# Altium project FIT_TCM.PrjPcb (part 5 of 9)

## Sheet FIT_TCM_LEMO_OUT.SchDoc: FIT_PM12 board
size 420 x 297 mm; CheckedBy: G.Kasprowicz; Author: INR Moscow; CompanyName: WUT ISE; DrawnBy: M.Podgórski; Organization: WUT ISE; Address1: PW ISE; Address2: Nowowiejska 15/19 00-665 Warsaw; Address3: gkasprow@gmail.com; Revision: 2; SheetNumber: -; SheetTotal: -; ModifiedBy: -; CheckedDate: -; Title2: Title 2; DivGrp: WUT ISE; Designer: INR RAS; ModifiedDate: -; ProjectName: Sensor Box
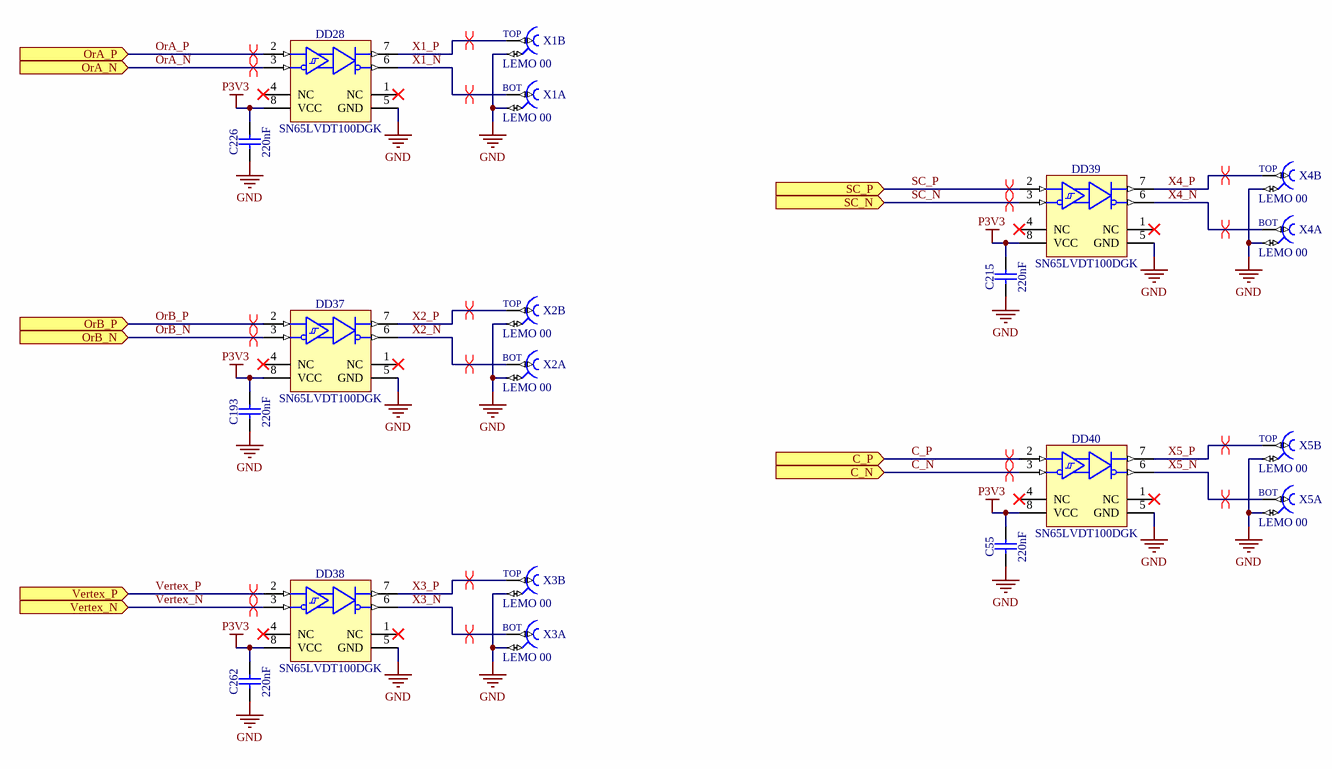
[diagram p13: FIT_TCM_LEMO_OUT.SchDoc]

### Parts
C55  220nF  [CAPC2012X135N]
C193  220nF  [CAPC2012X135N]
C215  220nF  [CAPC2012X135N]
C226  220nF  [CAPC2012X135N]
C262  220nF  [CAPC2012X135N]
DD28  SN65LVDT100DGK  [SOP65P490X110-8N]
DD37  SN65LVDT100DGK  [SOP65P490X110-8N]
DD38  SN65LVDT100DGK  [SOP65P490X110-8N]
DD39  SN65LVDT100DGK  [SOP65P490X110-8N]
DD40  SN65LVDT100DGK  [SOP65P490X110-8N]
X1  LEMO 00  [LEMO_EPY.00.250.NTN]  (parts A,B of 2)
X2  LEMO 00  [LEMO_EPY.00.250.NTN]  (parts A,B of 2)
X3  LEMO 00  [LEMO_EPY.00.250.NTN]  (parts A,B of 2)
X4  LEMO 00  [LEMO_EPY.00.250.NTN]  (parts A,B of 2)
X5  LEMO 00  [LEMO_EPY.00.250.NTN]  (parts A,B of 2)

### Ports
C_N (in), C_P (in), OrA_N (in), OrA_P (in), OrB_N (in), OrB_P (in), SC_N (in), SC_P (in), Vertex_N (in), Vertex_P (in)

### Nets
GND: C55.1 C193.1 C215.1 C226.1 C262.1 DD28.5(GND) DD37.5(GND) DD38.5(GND) DD39.5(GND) DD40.5(GND) X1.3 X2.3 X3.3 X4.3 X5.3
P3V3: C55.2 C193.2 C215.2 C226.2 C262.2 DD28.8(VCC) DD37.8(VCC) DD38.8(VCC) DD39.8(VCC) DD40.8(VCC)
C_N: DD40.3(B) ; port C_N
C_P: DD40.2(A) ; port C_P
OrA_N: DD28.3(B) ; port OrA_N
OrA_P: DD28.2(A) ; port OrA_P
OrB_N: DD37.3(B) ; port OrB_N
OrB_P: DD37.2(A) ; port OrB_P
SC_N: DD39.3(B) ; port SC_N
SC_P: DD39.2(A) ; port SC_P
Vertex_N: DD38.3(B) ; port Vertex_N
Vertex_P: DD38.2(A) ; port Vertex_P
X1_N: DD28.6(Z) X1.1
X1_P: DD28.7(Y) X1.2
X2_N: DD37.6(Z) X2.1
X2_P: DD37.7(Y) X2.2
X3_N: DD38.6(Z) X3.1
X3_P: DD38.7(Y) X3.2
X4_N: DD39.6(Z) X4.1
X4_P: DD39.7(Y) X4.2
X5_N: DD40.6(Z) X5.1
X5_P: DD40.7(Y) X5.2

Not connected (* = marked no-connect by the designer): DD28 1(NC)* 4(NC)*; DD37 1(NC)* 4(NC)*; DD38 1(NC)* 4(NC)*; DD39 1(NC)* 4(NC)*; DD40 1(NC)* 4(NC)*

### Layout directives
differential pair: C_N, C_P, OrA_N, OrA_P, OrB_N, OrB_P, SC_N, SC_P, Vertex_N, Vertex_P, X1_N, X1_P, X2_N, X2_P, X3_N, X3_P, X4_N, X4_P, X5_N, X5_P

### Notes on the sheet
- Project/Equipment
- Document
- Designer
- Drawn by
- Check.by
- Copyright WUT ISE 2024.
  This documentation describes Open Hardware and is licensed under the CERN OHL v.2. You may redistribute and modify this documentation under the terms of the CERN OHL v.2. (http://ohwr.org/CERNOHL). This documentation is distributed WITHOUT ANY EXPRESS OR IMPLIED WARRANTY, INCLUDING OF MERCHANTABILITY, SATISFACTORY QUALITY AND FITNESS FOR A PARTICULAR PURPOSE. Please see the CERN OHL v.2 for applicable conditions.
- Contact
- File
- Last Mod.
- Print Date
- Sheet
- Size
- A3
- of
- Rev
- (in symbol LEMO_EPY.00.250.NTN, part A) BOT
- (in symbol LEMO_EPY.00.250.NTN, part B) TOP

### Library data of the parts
C55 C193 C215 C226 C262 = CC0805_220NF_50V_10%_X7R: as C31-C35 on sheet FIT_TCM_SI5338A; Part Number: CC0805_220NF_50V_10%_X7R; Component Kind: Standard; Component Type: Standard; Pin Count: 2; Value: 220nF; Status: Preferred; Manufacturer Part Number: CC0805_220NF_50V_10%_X7R; Case: 0805; Mounted: Yes; Socket: No; SMD: Yes; Sense: No; Manufacturer1 Example: MURATA; Manufacturer1 ComponentHeight: 1.35mm; HelpURL: \\cern.ch\dfs\Applications\Altium\Datasheets\CC0805_X7R_MURATA.pdf; Author: CERN DEM JLC; CreateDate: 03.12.2007; LatestRevisionDate: 03.12.2007
DD28 DD37-DD40 = SN65LVDT100DGK: 2Gbps LVDS/LVPECL/CML to LVDS Translator/Repeater; Manufacturer: TEXAS INSTRUMENTS; PressFit: No; Bonding: No; Part Number: SN65LVDT100DGK; Component Kind: Standard; Component Type: Standard; Device: SN65LVDT100DGK; PackageDescription: SOP, 0.65mm Pitch; 8 Pin, 3.00mm W X 3.00mm L X 1.10mm H body, IPC Medium Density; Part Description: 2Gbps LVDS/LVPECL/CML to LVDS Translator/Repeater; Manufacturer Part Number: SN65LVDT100DGK; Pin Count: 8; Case: SSOP8; Mounted: Yes; Socket: No; SMD: Yes; Sense: No; ComponentHeight: 1.1mm; Author: CERN DEM HF; HelpURL: \\cern.ch\dfs\Applications\Altium\Datasheets\SN65LVDT100D.pdf; CreateDate: 21.06.2023; LatestRevisionDate: 21.06.2023
X1-X5 = LEMO_EPY.00.250.NTN: Dual Female Coax 1-2 Common Shield 3; Part Description: Size 00, Dual 50 Ohms Coaxial Elbow Sockets (90°); PressFit: No; SCEM: 09.46.11.186.0; Part Number: LEMO_EPY.00.250.NTN; Component Kind: Standard; Component Type: Standard; Pin Count: 4; Family: LEMO 00; Mounted: Yes; Socket: No; SMD: No; Sense: No; Status: None; Manufacturer: LEMO; Manufacturer Part Number: EPY.00.250.NTN; ComponentHeight: 14.8mm; HelpURL: \\cern.ch\dfs\Applications\Altium\Datasheets\LEMO_EPY.00.250.NTN.pdf; Author: CERN DEM JMW; CreateDate: 10.12.2008; LatestRevisionDate: 11.08.2009

## Sheet FPGA.SchDoc: FIT_PM12 board
size 420 x 297 mm; CheckedBy: G.Kasprowicz; Author: INR Moscow; CompanyName: WUT ISE; DrawnBy: M.Podgórski; Organization: WUT ISE; Address1: PW ISE; Address2: Nowowiejska 15/19 00-665 Warsaw; Address3: gkasprow@gmail.com; Revision: 2; SheetNumber: -; SheetTotal: -; ModifiedBy: -; CheckedDate: -; Title2: Title 2; DivGrp: WUT ISE; Designer: INR RAS; ModifiedDate: -; ProjectName: Sensor Box
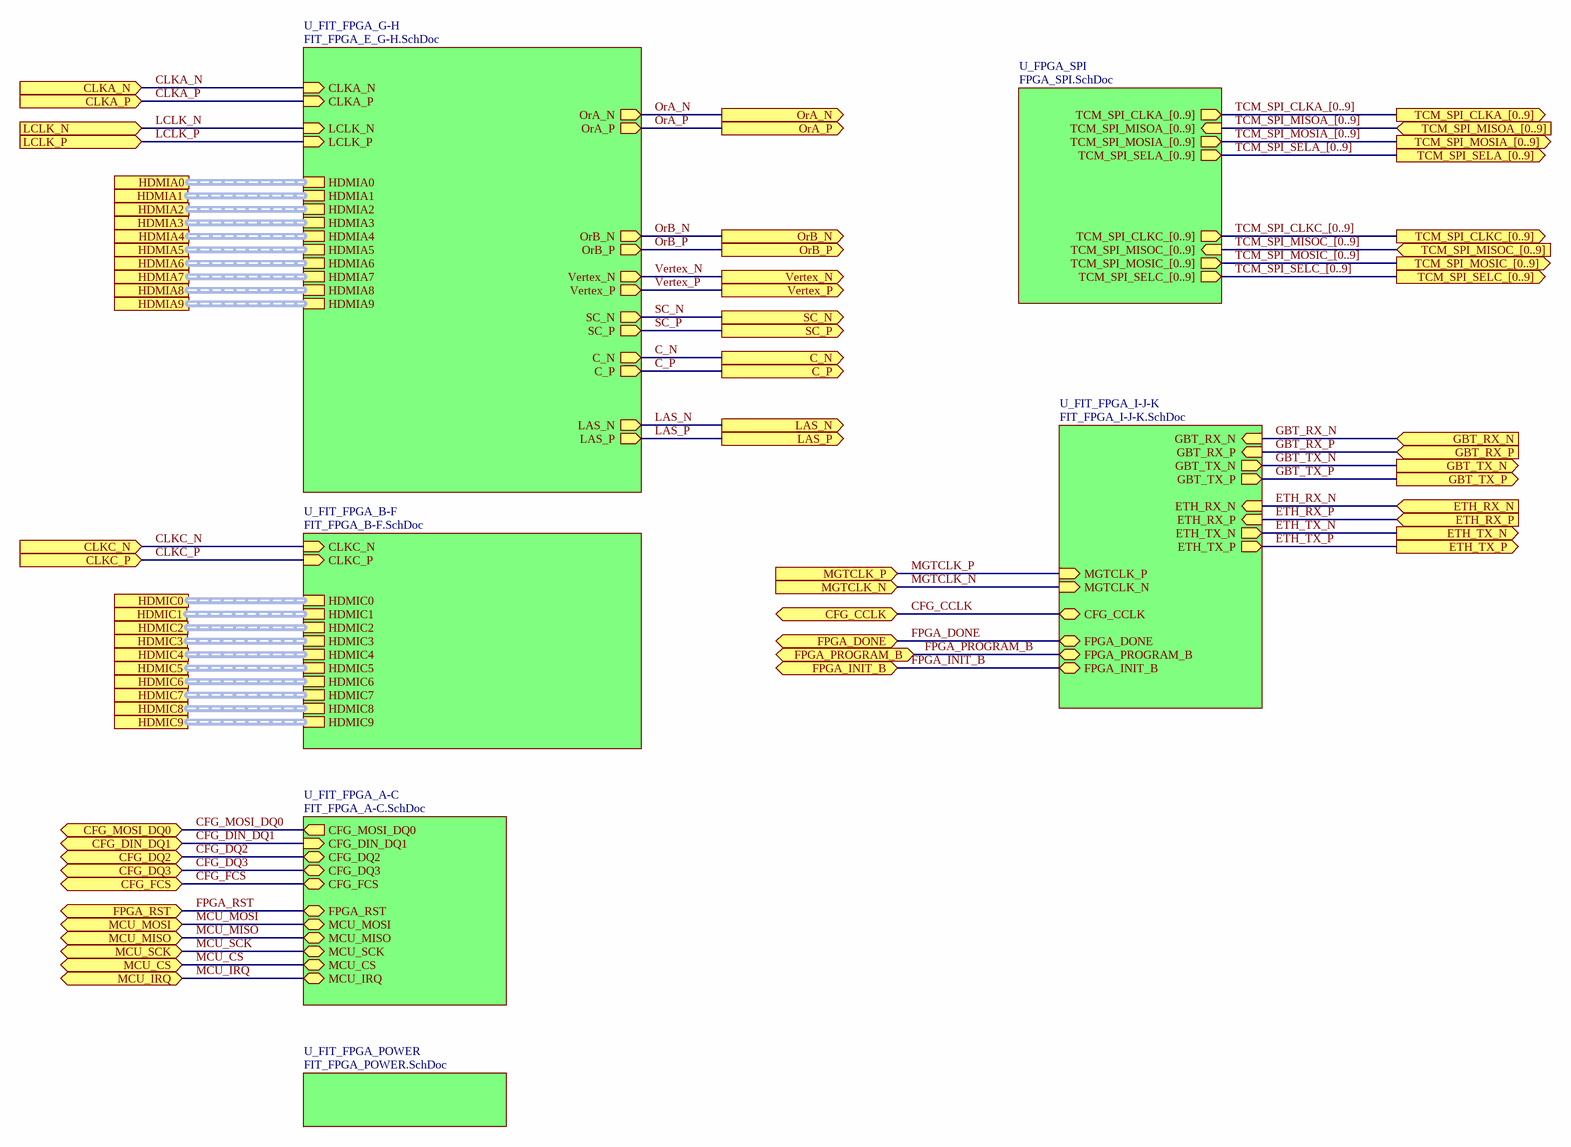
[diagram p14: FPGA.SchDoc]

### Sub-sheets
U_FIT_FPGA_A-C = FIT_FPGA_A-C.SchDoc: CFG_MOSI_DQ0 (out), CFG_DIN_DQ1 (in), CFG_DQ2 (bidir), CFG_DQ3 (bidir), CFG_FCS (bidir), MCU_MISO (bidir), MCU_CS (bidir), MCU_IRQ (bidir), MCU_MOSI (bidir), FPGA_RST (bidir), MCU_SCK (bidir)
U_FIT_FPGA_B-F = FIT_FPGA_B-F.SchDoc: CLKC_P (in), CLKC_N (in), HDMIC8 (harness HDMI_SIG), HDMIC9 (harness HDMI_SIG), HDMIC6 (harness HDMI_SIG), HDMIC7 (harness HDMI_SIG), HDMIC4 (harness HDMI_SIG), HDMIC5 (harness HDMI_SIG), HDMIC2 (harness HDMI_SIG), HDMIC3 (harness HDMI_SIG), HDMIC0 (harness HDMI_SIG), HDMIC1 (harness HDMI_SIG)
U_FIT_FPGA_G-H = FIT_FPGA_E_G-H.SchDoc: LCLK_P (in), LCLK_N (in), LAS_P (out), LAS_N (out), OrA_P (out), OrA_N (out), SC_P (out), SC_N (out), C_P (out), C_N (out), OrB_P (out), OrB_N (out), Vertex_P (out), Vertex_N (out), CLKA_P (in), CLKA_N (in), HDMIA8 (harness HDMI_SIG), HDMIA9 (harness HDMI_SIG), HDMIA6 (harness HDMI_SIG), HDMIA7 (harness HDMI_SIG), HDMIA4 (harness HDMI_SIG), HDMIA5 (harness HDMI_SIG), HDMIA2 (harness HDMI_SIG), HDMIA3 (harness HDMI_SIG), HDMIA0 (harness HDMI_SIG), HDMIA1 (harness HDMI_SIG)
U_FIT_FPGA_I-J-K = FIT_FPGA_I-J-K.SchDoc: ETH_TX_P (out), ETH_TX_N (out), ETH_RX_P (in), ETH_RX_N (in), GBT_RX_P (in), GBT_RX_N (in), GBT_TX_P (out), GBT_TX_N (out), MGTCLK_P (in), MGTCLK_N (in), CFG_CCLK (bidir), FPGA_PROGRAM_B (bidir), FPGA_INIT_B (bidir), FPGA_DONE (bidir)
U_FIT_FPGA_POWER = FIT_FPGA_POWER.SchDoc: no entries
U_FPGA_SPI = FPGA_SPI.SchDoc: TCM_SPI_SELC_[0..9] (out), TCM_SPI_MOSIC_[0..9] (out), TCM_SPI_MISOC_[0..9] (in), TCM_SPI_CLKC_[0..9] (out), TCM_SPI_CLKA_[0..9] (out), TCM_SPI_MOSIA_[0..9] (out), TCM_SPI_MISOA_[0..9] (in), TCM_SPI_SELA_[0..9] (out)

### Ports
C_N (out), C_P (out), CFG_CCLK (bidir), CFG_DIN_DQ1 (bidir), CFG_DQ2 (bidir), CFG_DQ3 (bidir), CFG_FCS (bidir), CFG_MOSI_DQ0 (bidir), CLKA_N (in), CLKA_P (in), CLKC_N (in), CLKC_P (in), ETH_RX_N (in), ETH_RX_P (in), ETH_TX_N (out), ETH_TX_P (out), FPGA_DONE (bidir), FPGA_INIT_B (bidir), FPGA_PROGRAM_B (bidir), FPGA_RST (bidir), GBT_RX_N (in), GBT_RX_P (in), GBT_TX_N (out), GBT_TX_P (out), HDMIA0 (harness HDMI_SIG), HDMIA1 (harness HDMI_SIG), HDMIA2 (harness HDMI_SIG), HDMIA3 (harness HDMI_SIG), HDMIA4 (harness HDMI_SIG), HDMIA5 (harness HDMI_SIG), HDMIA6 (harness HDMI_SIG), HDMIA7 (harness HDMI_SIG), HDMIA8 (harness HDMI_SIG), HDMIA9 (harness HDMI_SIG), HDMIC0 (harness HDMI_SIG), HDMIC1 (harness HDMI_SIG), HDMIC2 (harness HDMI_SIG), HDMIC3 (harness HDMI_SIG), HDMIC4 (harness HDMI_SIG), HDMIC5 (harness HDMI_SIG), HDMIC6 (harness HDMI_SIG), HDMIC7 (harness HDMI_SIG), HDMIC8 (harness HDMI_SIG), HDMIC9 (harness HDMI_SIG), LAS_N (out), LAS_P (out), LCLK_N (in), LCLK_P (in), MCU_CS (bidir), MCU_IRQ (bidir), MCU_MISO (bidir), MCU_MOSI (bidir), MCU_SCK (bidir), MGTCLK_N (in), MGTCLK_P (in), OrA_N (out), OrA_P (out), OrB_N (out), OrB_P (out), SC_N (out), SC_P (out), TCM_SPI_CLKA_[0..9] (out), TCM_SPI_CLKC_[0..9] (out), TCM_SPI_MISOA_[0..9] (in), TCM_SPI_MISOC_[0..9] (in), TCM_SPI_MOSIA_[0..9] (out), TCM_SPI_MOSIC_[0..9] (out), TCM_SPI_SELA_[0..9] (out), TCM_SPI_SELC_[0..9] (out), Vertex_N (out), Vertex_P (out)

### Nets
C_N: port C_N, sheet U_FIT_FPGA_G-H/C_N
C_P: port C_P, sheet U_FIT_FPGA_G-H/C_P
CFG_CCLK: port CFG_CCLK, sheet U_FIT_FPGA_I-J-K/CFG_CCLK
CFG_DIN_DQ1: port CFG_DIN_DQ1, sheet U_FIT_FPGA_A-C/CFG_DIN_DQ1
CFG_DQ2: port CFG_DQ2, sheet U_FIT_FPGA_A-C/CFG_DQ2
CFG_DQ3: port CFG_DQ3, sheet U_FIT_FPGA_A-C/CFG_DQ3
CFG_FCS: port CFG_FCS, sheet U_FIT_FPGA_A-C/CFG_FCS
CFG_MOSI_DQ0: port CFG_MOSI_DQ0, sheet U_FIT_FPGA_A-C/CFG_MOSI_DQ0
CLKA_N: port CLKA_N, sheet U_FIT_FPGA_G-H/CLKA_N
CLKA_P: port CLKA_P, sheet U_FIT_FPGA_G-H/CLKA_P
CLKC_N: port CLKC_N, sheet U_FIT_FPGA_B-F/CLKC_N
CLKC_P: port CLKC_P, sheet U_FIT_FPGA_B-F/CLKC_P
ETH_RX_N: port ETH_RX_N, sheet U_FIT_FPGA_I-J-K/ETH_RX_N
ETH_RX_P: port ETH_RX_P, sheet U_FIT_FPGA_I-J-K/ETH_RX_P
ETH_TX_N: port ETH_TX_N, sheet U_FIT_FPGA_I-J-K/ETH_TX_N
ETH_TX_P: port ETH_TX_P, sheet U_FIT_FPGA_I-J-K/ETH_TX_P
FPGA_DONE: port FPGA_DONE, sheet U_FIT_FPGA_I-J-K/FPGA_DONE
FPGA_INIT_B: port FPGA_INIT_B, sheet U_FIT_FPGA_I-J-K/FPGA_INIT_B
FPGA_PROGRAM_B: port FPGA_PROGRAM_B, sheet U_FIT_FPGA_I-J-K/FPGA_PROGRAM_B
FPGA_RST: port FPGA_RST, sheet U_FIT_FPGA_A-C/FPGA_RST
GBT_RX_N: port GBT_RX_N, sheet U_FIT_FPGA_I-J-K/GBT_RX_N
GBT_RX_P: port GBT_RX_P, sheet U_FIT_FPGA_I-J-K/GBT_RX_P
GBT_TX_N: port GBT_TX_N, sheet U_FIT_FPGA_I-J-K/GBT_TX_N
GBT_TX_P: port GBT_TX_P, sheet U_FIT_FPGA_I-J-K/GBT_TX_P
LAS_N: port LAS_N, sheet U_FIT_FPGA_G-H/LAS_N
LAS_P: port LAS_P, sheet U_FIT_FPGA_G-H/LAS_P
LCLK_N: port LCLK_N, sheet U_FIT_FPGA_G-H/LCLK_N
LCLK_P: port LCLK_P, sheet U_FIT_FPGA_G-H/LCLK_P
MCU_CS: port MCU_CS, sheet U_FIT_FPGA_A-C/MCU_CS
MCU_IRQ: port MCU_IRQ, sheet U_FIT_FPGA_A-C/MCU_IRQ
MCU_MISO: port MCU_MISO, sheet U_FIT_FPGA_A-C/MCU_MISO
MCU_MOSI: port MCU_MOSI, sheet U_FIT_FPGA_A-C/MCU_MOSI
MCU_SCK: port MCU_SCK, sheet U_FIT_FPGA_A-C/MCU_SCK
MGTCLK_N: port MGTCLK_N, sheet U_FIT_FPGA_I-J-K/MGTCLK_N
MGTCLK_P: port MGTCLK_P, sheet U_FIT_FPGA_I-J-K/MGTCLK_P
OrA_N: port OrA_N, sheet U_FIT_FPGA_G-H/OrA_N
OrA_P: port OrA_P, sheet U_FIT_FPGA_G-H/OrA_P
OrB_N: port OrB_N, sheet U_FIT_FPGA_G-H/OrB_N
OrB_P: port OrB_P, sheet U_FIT_FPGA_G-H/OrB_P
SC_N: port SC_N, sheet U_FIT_FPGA_G-H/SC_N
SC_P: port SC_P, sheet U_FIT_FPGA_G-H/SC_P
Vertex_N: port Vertex_N, sheet U_FIT_FPGA_G-H/Vertex_N
Vertex_P: port Vertex_P, sheet U_FIT_FPGA_G-H/Vertex_P

### Buses and harness runs
bus TCM_SPI_CLKA_[0..9] = port TCM_SPI_CLKA_[0..9] = sheet U_FPGA_SPI/TCM_SPI_CLKA_[0..9]
bus TCM_SPI_CLKC_[0..9] = port TCM_SPI_CLKC_[0..9] = sheet U_FPGA_SPI/TCM_SPI_CLKC_[0..9]
bus TCM_SPI_MISOA_[0..9] = port TCM_SPI_MISOA_[0..9] = sheet U_FPGA_SPI/TCM_SPI_MISOA_[0..9]
bus TCM_SPI_MISOC_[0..9] = port TCM_SPI_MISOC_[0..9] = sheet U_FPGA_SPI/TCM_SPI_MISOC_[0..9]
bus TCM_SPI_MOSIA_[0..9] = port TCM_SPI_MOSIA_[0..9] = sheet U_FPGA_SPI/TCM_SPI_MOSIA_[0..9]
bus TCM_SPI_MOSIC_[0..9] = port TCM_SPI_MOSIC_[0..9] = sheet U_FPGA_SPI/TCM_SPI_MOSIC_[0..9]
bus TCM_SPI_SELA_[0..9] = port TCM_SPI_SELA_[0..9] = sheet U_FPGA_SPI/TCM_SPI_SELA_[0..9]
bus TCM_SPI_SELC_[0..9] = port TCM_SPI_SELC_[0..9] = sheet U_FPGA_SPI/TCM_SPI_SELC_[0..9]
harness port HDMIA0 = sheet U_FIT_FPGA_G-H/HDMIA0
harness port HDMIA1 = sheet U_FIT_FPGA_G-H/HDMIA1
harness port HDMIA2 = sheet U_FIT_FPGA_G-H/HDMIA2
harness port HDMIA3 = sheet U_FIT_FPGA_G-H/HDMIA3
harness port HDMIA4 = sheet U_FIT_FPGA_G-H/HDMIA4
harness port HDMIA5 = sheet U_FIT_FPGA_G-H/HDMIA5
harness port HDMIA6 = sheet U_FIT_FPGA_G-H/HDMIA6
harness port HDMIA7 = sheet U_FIT_FPGA_G-H/HDMIA7
harness port HDMIA8 = sheet U_FIT_FPGA_G-H/HDMIA8
harness port HDMIA9 = sheet U_FIT_FPGA_G-H/HDMIA9
harness port HDMIC0 = sheet U_FIT_FPGA_B-F/HDMIC0
harness port HDMIC1 = sheet U_FIT_FPGA_B-F/HDMIC1
harness port HDMIC2 = sheet U_FIT_FPGA_B-F/HDMIC2
harness port HDMIC3 = sheet U_FIT_FPGA_B-F/HDMIC3
harness port HDMIC4 = sheet U_FIT_FPGA_B-F/HDMIC4
harness port HDMIC5 = sheet U_FIT_FPGA_B-F/HDMIC5
harness port HDMIC6 = sheet U_FIT_FPGA_B-F/HDMIC6
harness port HDMIC7 = sheet U_FIT_FPGA_B-F/HDMIC7
harness port HDMIC8 = sheet U_FIT_FPGA_B-F/HDMIC8
harness port HDMIC9 = sheet U_FIT_FPGA_B-F/HDMIC9

### Notes on the sheet
- Project/Equipment
- Document
- Designer
- Drawn by
- Check.by
- Copyright WUT ISE 2024.
  This documentation describes Open Hardware and is licensed under the CERN OHL v.2. You may redistribute and modify this documentation under the terms of the CERN OHL v.2. (http://ohwr.org/CERNOHL). This documentation is distributed WITHOUT ANY EXPRESS OR IMPLIED WARRANTY, INCLUDING OF MERCHANTABILITY, SATISFACTORY QUALITY AND FITNESS FOR A PARTICULAR PURPOSE. Please see the CERN OHL v.2 for applicable conditions.
- Contact
- File
- Last Mod.
- Print Date
- Sheet
- Size
- A3
- of
- Rev

## Sheet FIT_FPGA_E_G-H.SchDoc: FIT_PM12 board
size 420 x 297 mm; CheckedBy: G.Kasprowicz; Author: INR Moscow; CompanyName: WUT ISE; DrawnBy: M.Podgórski; Organization: WUT ISE; Address1: PW ISE; Address2: Nowowiejska 15/19 00-665 Warsaw; Address3: gkasprow@gmail.com; Revision: 2; SheetNumber: -; SheetTotal: -; ModifiedBy: -; CheckedDate: -; Title2: Title 2; DivGrp: WUT ISE; Designer: INR RAS; ModifiedDate: -; ProjectName: Sensor Box
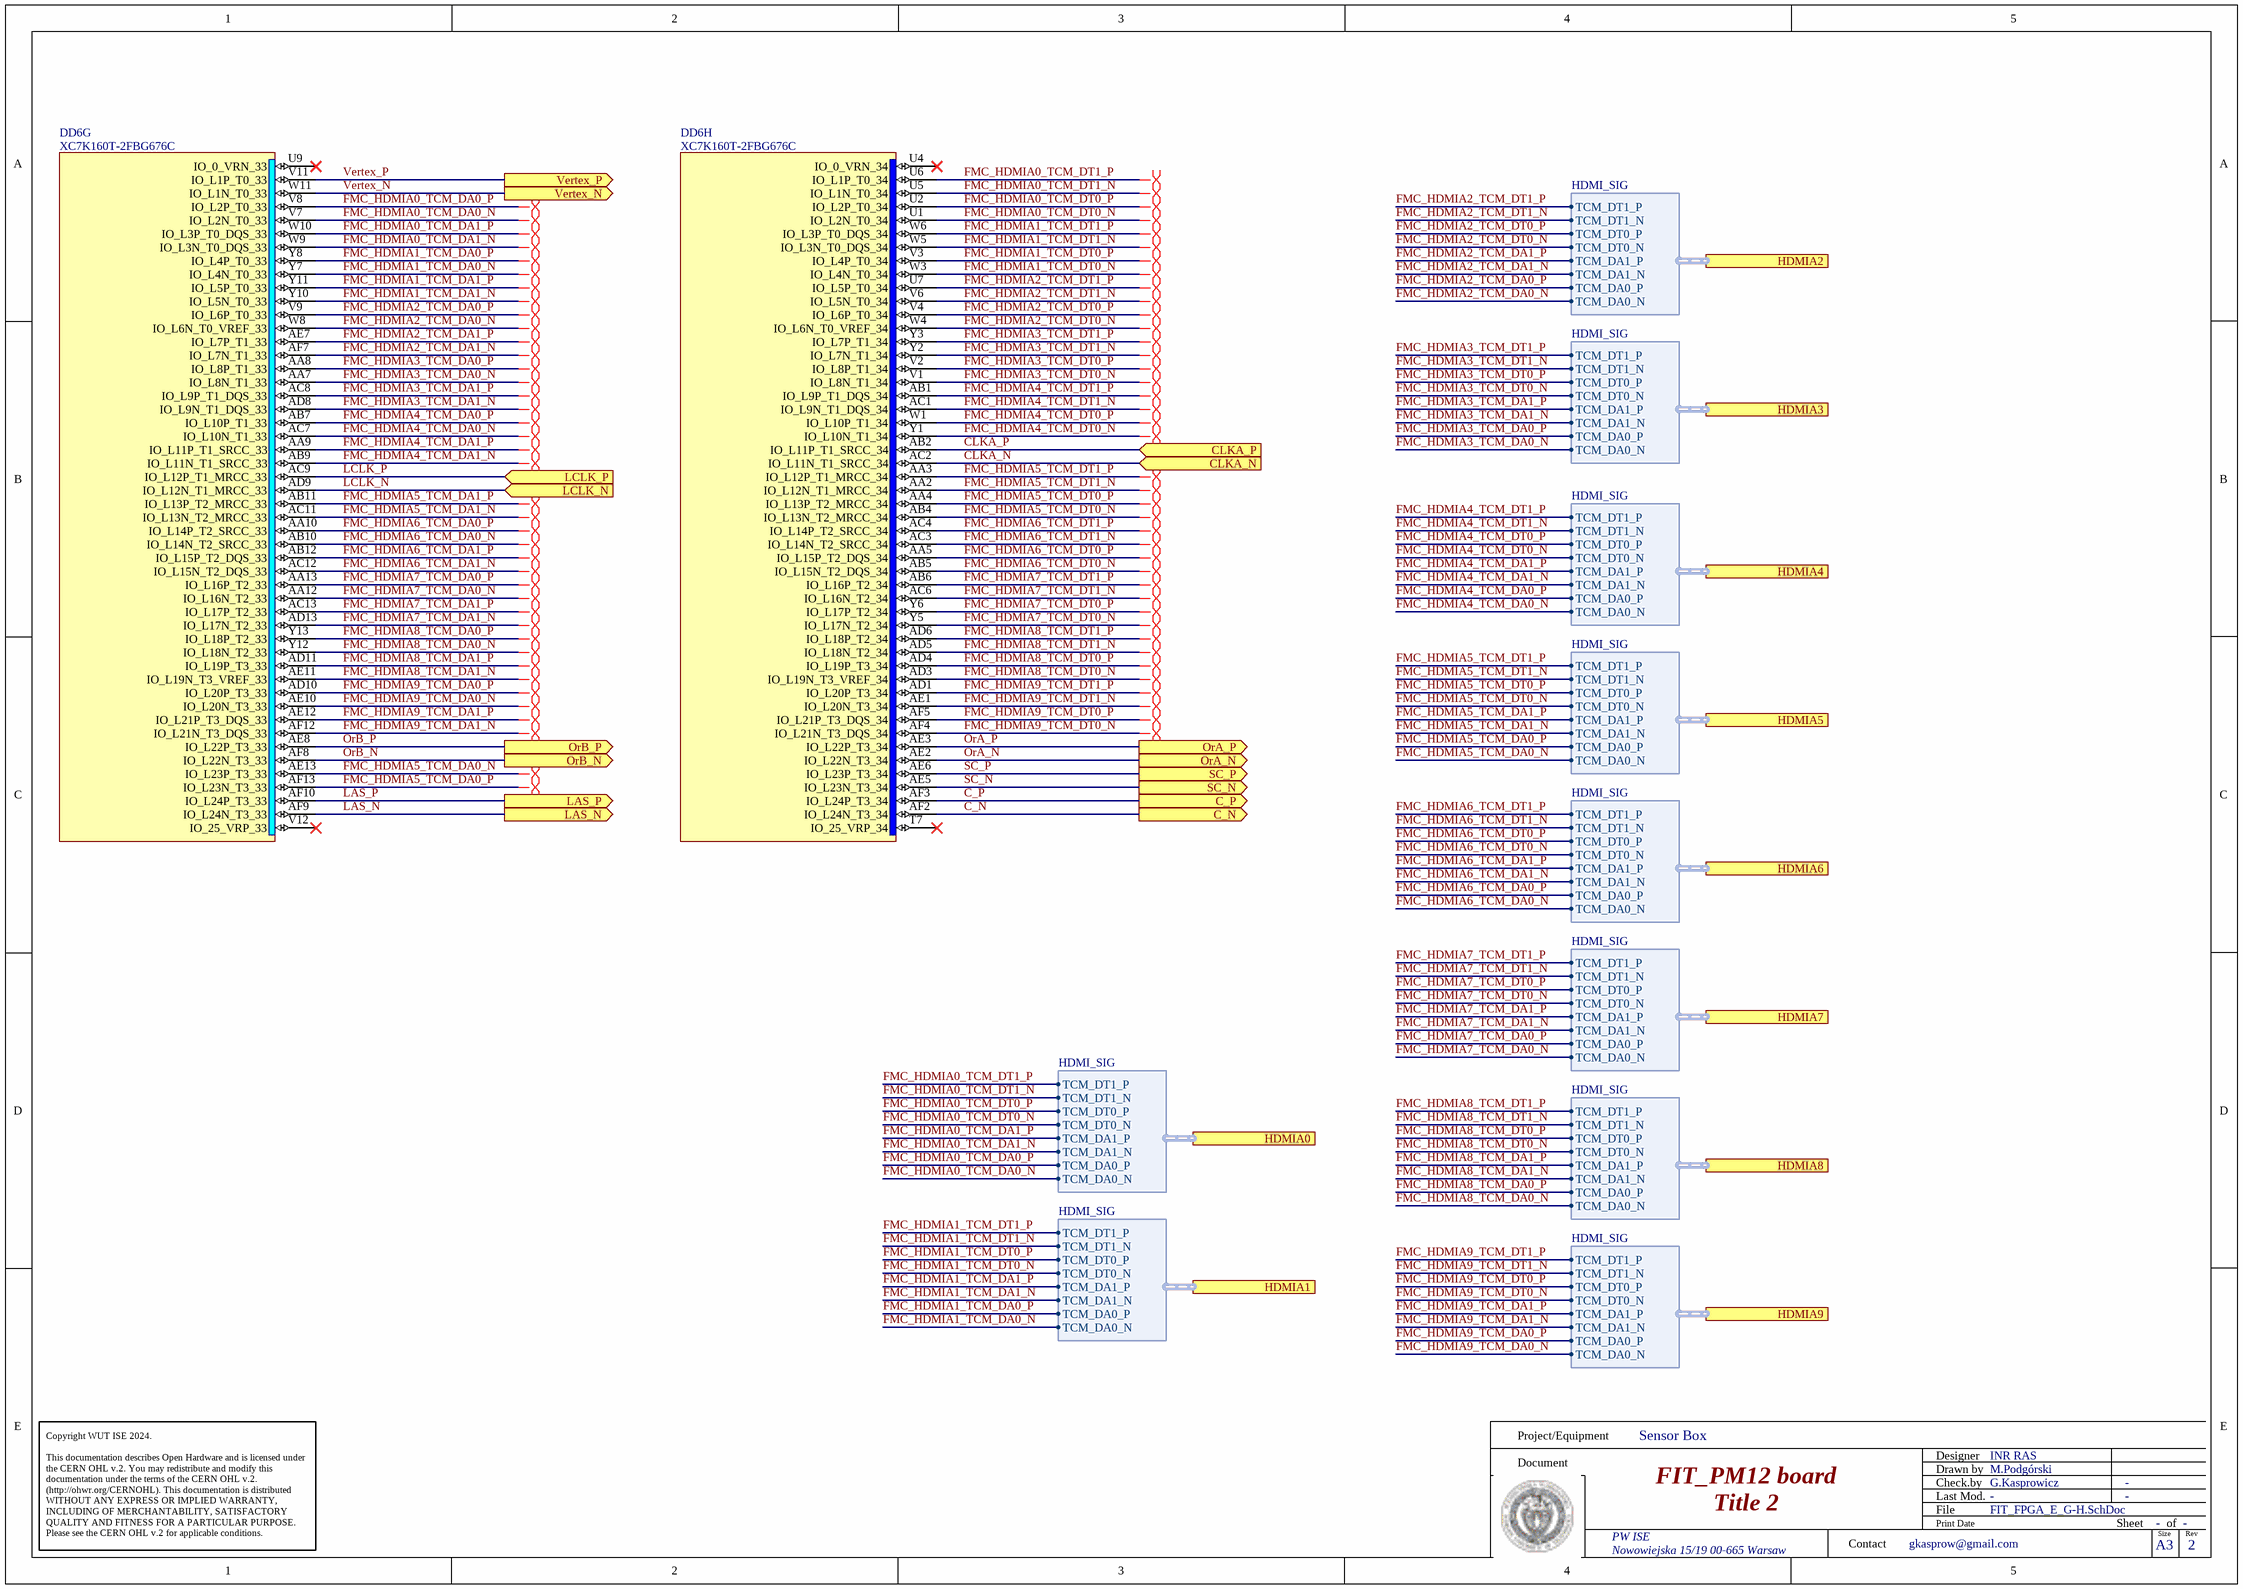
[diagram p15: FIT_FPGA_E_G-H.SchDoc]

### Parts
DD6  XC7K160T-2FBG676C  [BGA676C100P26X26_2700X2700X254]  (parts G,H of 15)

### Ports
C_N (out), C_P (out), CLKA_N (in), CLKA_P (in), HDMIA0 (harness HDMI_SIG), HDMIA1 (harness HDMI_SIG), HDMIA2 (harness HDMI_SIG), HDMIA3 (harness HDMI_SIG), HDMIA4 (harness HDMI_SIG), HDMIA5 (harness HDMI_SIG), HDMIA6 (harness HDMI_SIG), HDMIA7 (harness HDMI_SIG), HDMIA8 (harness HDMI_SIG), HDMIA9 (harness HDMI_SIG), LAS_N (out), LAS_P (out), LCLK_N (in), LCLK_P (in), OrA_N (out), OrA_P (out), OrB_N (out), OrB_P (out), SC_N (out), SC_P (out), Vertex_N (out), Vertex_P (out)

### Harnesses
HDMI_SIG: TCM_DT1_P, TCM_DT1_N, TCM_DT0_P, TCM_DT0_N, TCM_DA1_P, TCM_DA1_N, TCM_DA0_P, TCM_DA0_N

### Nets
C_N: DD6.AF2(IO_L24N_T3_34) ; port C_N
C_P: DD6.AF3(IO_L24P_T3_34) ; port C_P
CLKA_N: DD6.AC2(IO_L11N_T1_SRCC_34) ; port CLKA_N
CLKA_P: DD6.AB2(IO_L11P_T1_SRCC_34) ; port CLKA_P
FMC_HDMIA0_TCM_DA0_N: DD6.V7(IO_L2N_T0_33) ; port HDMIA0.TCM_DA0_N  [project net HDMIA0.TCM_DA0_N]
FMC_HDMIA0_TCM_DA0_P: DD6.V8(IO_L2P_T0_33) ; port HDMIA0.TCM_DA0_P  [project net HDMIA0.TCM_DA0_P]
FMC_HDMIA0_TCM_DA1_N: DD6.W9(IO_L3N_T0_DQS_33) ; port HDMIA0.TCM_DA1_N  [project net HDMIA0.TCM_DA1_N]
FMC_HDMIA0_TCM_DA1_P: DD6.W10(IO_L3P_T0_DQS_33) ; port HDMIA0.TCM_DA1_P  [project net HDMIA0.TCM_DA1_P]
FMC_HDMIA0_TCM_DT0_N: DD6.U1(IO_L2N_T0_34) ; port HDMIA0.TCM_DT0_N  [project net HDMIA0.TCM_DT0_N]
FMC_HDMIA0_TCM_DT0_P: DD6.U2(IO_L2P_T0_34) ; port HDMIA0.TCM_DT0_P  [project net HDMIA0.TCM_DT0_P]
FMC_HDMIA0_TCM_DT1_N: DD6.U5(IO_L1N_T0_34) ; port HDMIA0.TCM_DT1_N  [project net HDMIA0.TCM_DT1_N]
FMC_HDMIA0_TCM_DT1_P: DD6.U6(IO_L1P_T0_34) ; port HDMIA0.TCM_DT1_P  [project net HDMIA0.TCM_DT1_P]
FMC_HDMIA1_TCM_DA0_N: DD6.Y7(IO_L4N_T0_33) ; port HDMIA1.TCM_DA0_N  [project net HDMIA1.TCM_DA0_N]
FMC_HDMIA1_TCM_DA0_P: DD6.Y8(IO_L4P_T0_33) ; port HDMIA1.TCM_DA0_P  [project net HDMIA1.TCM_DA0_P]
FMC_HDMIA1_TCM_DA1_N: DD6.Y10(IO_L5N_T0_33) ; port HDMIA1.TCM_DA1_N  [project net HDMIA1.TCM_DA1_N]
FMC_HDMIA1_TCM_DA1_P: DD6.Y11(IO_L5P_T0_33) ; port HDMIA1.TCM_DA1_P  [project net HDMIA1.TCM_DA1_P]
FMC_HDMIA1_TCM_DT0_N: DD6.W3(IO_L4N_T0_34) ; port HDMIA1.TCM_DT0_N  [project net HDMIA1.TCM_DT0_N]
FMC_HDMIA1_TCM_DT0_P: DD6.V3(IO_L4P_T0_34) ; port HDMIA1.TCM_DT0_P  [project net HDMIA1.TCM_DT0_P]
FMC_HDMIA1_TCM_DT1_N: DD6.W5(IO_L3N_T0_DQS_34) ; port HDMIA1.TCM_DT1_N  [project net HDMIA1.TCM_DT1_N]
FMC_HDMIA1_TCM_DT1_P: DD6.W6(IO_L3P_T0_DQS_34) ; port HDMIA1.TCM_DT1_P  [project net HDMIA1.TCM_DT1_P]
FMC_HDMIA2_TCM_DA0_N: DD6.W8(IO_L6N_T0_VREF_33) ; port HDMIA2.TCM_DA0_N  [project net HDMIA2.TCM_DA0_N]
FMC_HDMIA2_TCM_DA0_P: DD6.V9(IO_L6P_T0_33) ; port HDMIA2.TCM_DA0_P  [project net HDMIA2.TCM_DA0_P]
FMC_HDMIA2_TCM_DA1_N: DD6.AF7(IO_L7N_T1_33) ; port HDMIA2.TCM_DA1_N  [project net HDMIA2.TCM_DA1_N]
FMC_HDMIA2_TCM_DA1_P: DD6.AE7(IO_L7P_T1_33) ; port HDMIA2.TCM_DA1_P  [project net HDMIA2.TCM_DA1_P]
FMC_HDMIA2_TCM_DT0_N: DD6.W4(IO_L6N_T0_VREF_34) ; port HDMIA2.TCM_DT0_N  [project net HDMIA2.TCM_DT0_N]
FMC_HDMIA2_TCM_DT0_P: DD6.V4(IO_L6P_T0_34) ; port HDMIA2.TCM_DT0_P  [project net HDMIA2.TCM_DT0_P]
FMC_HDMIA2_TCM_DT1_N: DD6.V6(IO_L5N_T0_34) ; port HDMIA2.TCM_DT1_N  [project net HDMIA2.TCM_DT1_N]
FMC_HDMIA2_TCM_DT1_P: DD6.U7(IO_L5P_T0_34) ; port HDMIA2.TCM_DT1_P  [project net HDMIA2.TCM_DT1_P]
FMC_HDMIA3_TCM_DA0_N: DD6.AA7(IO_L8N_T1_33) ; port HDMIA3.TCM_DA0_N  [project net HDMIA3.TCM_DA0_N]
FMC_HDMIA3_TCM_DA0_P: DD6.AA8(IO_L8P_T1_33) ; port HDMIA3.TCM_DA0_P  [project net HDMIA3.TCM_DA0_P]
FMC_HDMIA3_TCM_DA1_N: DD6.AD8(IO_L9N_T1_DQS_33) ; port HDMIA3.TCM_DA1_N  [project net HDMIA3.TCM_DA1_N]
FMC_HDMIA3_TCM_DA1_P: DD6.AC8(IO_L9P_T1_DQS_33) ; port HDMIA3.TCM_DA1_P  [project net HDMIA3.TCM_DA1_P]
FMC_HDMIA3_TCM_DT0_N: DD6.V1(IO_L8N_T1_34) ; port HDMIA3.TCM_DT0_N  [project net HDMIA3.TCM_DT0_N]
FMC_HDMIA3_TCM_DT0_P: DD6.V2(IO_L8P_T1_34) ; port HDMIA3.TCM_DT0_P  [project net HDMIA3.TCM_DT0_P]
FMC_HDMIA3_TCM_DT1_N: DD6.Y2(IO_L7N_T1_34) ; port HDMIA3.TCM_DT1_N  [project net HDMIA3.TCM_DT1_N]
FMC_HDMIA3_TCM_DT1_P: DD6.Y3(IO_L7P_T1_34) ; port HDMIA3.TCM_DT1_P  [project net HDMIA3.TCM_DT1_P]
FMC_HDMIA4_TCM_DA0_N: DD6.AC7(IO_L10N_T1_33) ; port HDMIA4.TCM_DA0_N  [project net HDMIA4.TCM_DA0_N]
FMC_HDMIA4_TCM_DA0_P: DD6.AB7(IO_L10P_T1_33) ; port HDMIA4.TCM_DA0_P  [project net HDMIA4.TCM_DA0_P]
FMC_HDMIA4_TCM_DA1_N: DD6.AB9(IO_L11N_T1_SRCC_33) ; port HDMIA4.TCM_DA1_N  [project net HDMIA4.TCM_DA1_N]
FMC_HDMIA4_TCM_DA1_P: DD6.AA9(IO_L11P_T1_SRCC_33) ; port HDMIA4.TCM_DA1_P  [project net HDMIA4.TCM_DA1_P]
FMC_HDMIA4_TCM_DT0_N: DD6.Y1(IO_L10N_T1_34) ; port HDMIA4.TCM_DT0_N  [project net HDMIA4.TCM_DT0_N]
FMC_HDMIA4_TCM_DT0_P: DD6.W1(IO_L10P_T1_34) ; port HDMIA4.TCM_DT0_P  [project net HDMIA4.TCM_DT0_P]
FMC_HDMIA4_TCM_DT1_N: DD6.AC1(IO_L9N_T1_DQS_34) ; port HDMIA4.TCM_DT1_N  [project net HDMIA4.TCM_DT1_N]
FMC_HDMIA4_TCM_DT1_P: DD6.AB1(IO_L9P_T1_DQS_34) ; port HDMIA4.TCM_DT1_P  [project net HDMIA4.TCM_DT1_P]
FMC_HDMIA5_TCM_DA0_N: DD6.AE13(IO_L23P_T3_33) ; port HDMIA5.TCM_DA0_N  [project net HDMIA5.TCM_DA0_N]
FMC_HDMIA5_TCM_DA0_P: DD6.AF13(IO_L23N_T3_33) ; port HDMIA5.TCM_DA0_P  [project net HDMIA5.TCM_DA0_P]
FMC_HDMIA5_TCM_DA1_N: DD6.AC11(IO_L13N_T2_MRCC_33) ; port HDMIA5.TCM_DA1_N  [project net HDMIA5.TCM_DA1_N]
FMC_HDMIA5_TCM_DA1_P: DD6.AB11(IO_L13P_T2_MRCC_33) ; port HDMIA5.TCM_DA1_P  [project net HDMIA5.TCM_DA1_P]
FMC_HDMIA5_TCM_DT0_N: DD6.AB4(IO_L13N_T2_MRCC_34) ; port HDMIA5.TCM_DT0_N  [project net HDMIA5.TCM_DT0_N]
FMC_HDMIA5_TCM_DT0_P: DD6.AA4(IO_L13P_T2_MRCC_34) ; port HDMIA5.TCM_DT0_P  [project net HDMIA5.TCM_DT0_P]
FMC_HDMIA5_TCM_DT1_N: DD6.AA2(IO_L12N_T1_MRCC_34) ; port HDMIA5.TCM_DT1_N  [project net HDMIA5.TCM_DT1_N]
FMC_HDMIA5_TCM_DT1_P: DD6.AA3(IO_L12P_T1_MRCC_34) ; port HDMIA5.TCM_DT1_P  [project net HDMIA5.TCM_DT1_P]
FMC_HDMIA6_TCM_DA0_N: DD6.AB10(IO_L14N_T2_SRCC_33) ; port HDMIA6.TCM_DA0_N  [project net HDMIA6.TCM_DA0_N]
FMC_HDMIA6_TCM_DA0_P: DD6.AA10(IO_L14P_T2_SRCC_33) ; port HDMIA6.TCM_DA0_P  [project net HDMIA6.TCM_DA0_P]
FMC_HDMIA6_TCM_DA1_N: DD6.AC12(IO_L15N_T2_DQS_33) ; port HDMIA6.TCM_DA1_N  [project net HDMIA6.TCM_DA1_N]
FMC_HDMIA6_TCM_DA1_P: DD6.AB12(IO_L15P_T2_DQS_33) ; port HDMIA6.TCM_DA1_P  [project net HDMIA6.TCM_DA1_P]
FMC_HDMIA6_TCM_DT0_N: DD6.AB5(IO_L15N_T2_DQS_34) ; port HDMIA6.TCM_DT0_N  [project net HDMIA6.TCM_DT0_N]
FMC_HDMIA6_TCM_DT0_P: DD6.AA5(IO_L15P_T2_DQS_34) ; port HDMIA6.TCM_DT0_P  [project net HDMIA6.TCM_DT0_P]
FMC_HDMIA6_TCM_DT1_N: DD6.AC3(IO_L14N_T2_SRCC_34) ; port HDMIA6.TCM_DT1_N  [project net HDMIA6.TCM_DT1_N]
FMC_HDMIA6_TCM_DT1_P: DD6.AC4(IO_L14P_T2_SRCC_34) ; port HDMIA6.TCM_DT1_P  [project net HDMIA6.TCM_DT1_P]
FMC_HDMIA7_TCM_DA0_N: DD6.AA12(IO_L16N_T2_33) ; port HDMIA7.TCM_DA0_N  [project net HDMIA7.TCM_DA0_N]
FMC_HDMIA7_TCM_DA0_P: DD6.AA13(IO_L16P_T2_33) ; port HDMIA7.TCM_DA0_P  [project net HDMIA7.TCM_DA0_P]
FMC_HDMIA7_TCM_DA1_N: DD6.AD13(IO_L17N_T2_33) ; port HDMIA7.TCM_DA1_N  [project net HDMIA7.TCM_DA1_N]
FMC_HDMIA7_TCM_DA1_P: DD6.AC13(IO_L17P_T2_33) ; port HDMIA7.TCM_DA1_P  [project net HDMIA7.TCM_DA1_P]
FMC_HDMIA7_TCM_DT0_N: DD6.Y5(IO_L17N_T2_34) ; port HDMIA7.TCM_DT0_N  [project net HDMIA7.TCM_DT0_N]
FMC_HDMIA7_TCM_DT0_P: DD6.Y6(IO_L17P_T2_34) ; port HDMIA7.TCM_DT0_P  [project net HDMIA7.TCM_DT0_P]
FMC_HDMIA7_TCM_DT1_N: DD6.AC6(IO_L16N_T2_34) ; port HDMIA7.TCM_DT1_N  [project net HDMIA7.TCM_DT1_N]
FMC_HDMIA7_TCM_DT1_P: DD6.AB6(IO_L16P_T2_34) ; port HDMIA7.TCM_DT1_P  [project net HDMIA7.TCM_DT1_P]
FMC_HDMIA8_TCM_DA0_N: DD6.Y12(IO_L18N_T2_33) ; port HDMIA8.TCM_DA0_N  [project net HDMIA8.TCM_DA0_N]
FMC_HDMIA8_TCM_DA0_P: DD6.Y13(IO_L18P_T2_33) ; port HDMIA8.TCM_DA0_P  [project net HDMIA8.TCM_DA0_P]
FMC_HDMIA8_TCM_DA1_N: DD6.AE11(IO_L19N_T3_VREF_33) ; port HDMIA8.TCM_DA1_N  [project net HDMIA8.TCM_DA1_N]
FMC_HDMIA8_TCM_DA1_P: DD6.AD11(IO_L19P_T3_33) ; port HDMIA8.TCM_DA1_P  [project net HDMIA8.TCM_DA1_P]
FMC_HDMIA8_TCM_DT0_N: DD6.AD3(IO_L19N_T3_VREF_34) ; port HDMIA8.TCM_DT0_N  [project net HDMIA8.TCM_DT0_N]
FMC_HDMIA8_TCM_DT0_P: DD6.AD4(IO_L19P_T3_34) ; port HDMIA8.TCM_DT0_P  [project net HDMIA8.TCM_DT0_P]
FMC_HDMIA8_TCM_DT1_N: DD6.AD5(IO_L18N_T2_34) ; port HDMIA8.TCM_DT1_N  [project net HDMIA8.TCM_DT1_N]
FMC_HDMIA8_TCM_DT1_P: DD6.AD6(IO_L18P_T2_34) ; port HDMIA8.TCM_DT1_P  [project net HDMIA8.TCM_DT1_P]
FMC_HDMIA9_TCM_DA0_N: DD6.AE10(IO_L20N_T3_33) ; port HDMIA9.TCM_DA0_N  [project net HDMIA9.TCM_DA0_N]
FMC_HDMIA9_TCM_DA0_P: DD6.AD10(IO_L20P_T3_33) ; port HDMIA9.TCM_DA0_P  [project net HDMIA9.TCM_DA0_P]
FMC_HDMIA9_TCM_DA1_N: DD6.AF12(IO_L21N_T3_DQS_33) ; port HDMIA9.TCM_DA1_N  [project net HDMIA9.TCM_DA1_N]
FMC_HDMIA9_TCM_DA1_P: DD6.AE12(IO_L21P_T3_DQS_33) ; port HDMIA9.TCM_DA1_P  [project net HDMIA9.TCM_DA1_P]
FMC_HDMIA9_TCM_DT0_N: DD6.AF4(IO_L21N_T3_DQS_34) ; port HDMIA9.TCM_DT0_N  [project net HDMIA9.TCM_DT0_N]
FMC_HDMIA9_TCM_DT0_P: DD6.AF5(IO_L21P_T3_DQS_34) ; port HDMIA9.TCM_DT0_P  [project net HDMIA9.TCM_DT0_P]
FMC_HDMIA9_TCM_DT1_N: DD6.AE1(IO_L20N_T3_34) ; port HDMIA9.TCM_DT1_N  [project net HDMIA9.TCM_DT1_N]
FMC_HDMIA9_TCM_DT1_P: DD6.AD1(IO_L20P_T3_34) ; port HDMIA9.TCM_DT1_P  [project net HDMIA9.TCM_DT1_P]
LAS_N: DD6.AF9(IO_L24N_T3_33) ; port LAS_N
LAS_P: DD6.AF10(IO_L24P_T3_33) ; port LAS_P
LCLK_N: DD6.AD9(IO_L12N_T1_MRCC_33) ; port LCLK_N
LCLK_P: DD6.AC9(IO_L12P_T1_MRCC_33) ; port LCLK_P
OrA_N: DD6.AE2(IO_L22N_T3_34) ; port OrA_N
OrA_P: DD6.AE3(IO_L22P_T3_34) ; port OrA_P
OrB_N: DD6.AF8(IO_L22N_T3_33) ; port OrB_N
OrB_P: DD6.AE8(IO_L22P_T3_33) ; port OrB_P
SC_N: DD6.AE5(IO_L23N_T3_34) ; port SC_N
SC_P: DD6.AE6(IO_L23P_T3_34) ; port SC_P
Vertex_N: DD6.W11(IO_L1N_T0_33) ; port Vertex_N
Vertex_P: DD6.V11(IO_L1P_T0_33) ; port Vertex_P

Not connected (* = marked no-connect by the designer): DD6 T7(IO_25_VRP_34)* U4(IO_0_VRN_34)* U9(IO_0_VRN_33)* V12(IO_25_VRP_33)*

### Layout directives
differential pair: HDMIA0.TCM_DA0_N, HDMIA0.TCM_DA0_P, HDMIA0.TCM_DA1_N, HDMIA0.TCM_DA1_P, HDMIA0.TCM_DT0_N, HDMIA0.TCM_DT0_P, HDMIA0.TCM_DT1_N, HDMIA0.TCM_DT1_P, HDMIA1.TCM_DA0_N, HDMIA1.TCM_DA0_P, HDMIA1.TCM_DA1_N, HDMIA1.TCM_DA1_P, HDMIA1.TCM_DT0_N, HDMIA1.TCM_DT0_P, HDMIA1.TCM_DT1_N, HDMIA1.TCM_DT1_P, HDMIA2.TCM_DA0_N, HDMIA2.TCM_DA0_P, HDMIA2.TCM_DA1_N, HDMIA2.TCM_DA1_P, HDMIA2.TCM_DT0_N, HDMIA2.TCM_DT0_P, HDMIA2.TCM_DT1_N, HDMIA2.TCM_DT1_P, HDMIA3.TCM_DA0_N, HDMIA3.TCM_DA0_P, HDMIA3.TCM_DA1_N, HDMIA3.TCM_DA1_P, HDMIA3.TCM_DT0_N, HDMIA3.TCM_DT0_P, HDMIA3.TCM_DT1_N, HDMIA3.TCM_DT1_P, HDMIA4.TCM_DA0_N, HDMIA4.TCM_DA0_P, HDMIA4.TCM_DA1_N, HDMIA4.TCM_DA1_P, HDMIA4.TCM_DT0_N, HDMIA4.TCM_DT0_P, HDMIA4.TCM_DT1_N, HDMIA4.TCM_DT1_P, HDMIA5.TCM_DA0_N, HDMIA5.TCM_DA0_P, HDMIA5.TCM_DA1_N, HDMIA5.TCM_DA1_P, HDMIA5.TCM_DT0_N, HDMIA5.TCM_DT0_P, HDMIA5.TCM_DT1_N, HDMIA5.TCM_DT1_P, HDMIA6.TCM_DA0_N, HDMIA6.TCM_DA0_P, HDMIA6.TCM_DA1_N, HDMIA6.TCM_DA1_P, HDMIA6.TCM_DT0_N, HDMIA6.TCM_DT0_P, HDMIA6.TCM_DT1_N, HDMIA6.TCM_DT1_P, HDMIA7.TCM_DA0_N, HDMIA7.TCM_DA0_P, HDMIA7.TCM_DA1_N, HDMIA7.TCM_DA1_P, HDMIA7.TCM_DT0_N, HDMIA7.TCM_DT0_P, HDMIA7.TCM_DT1_N, HDMIA7.TCM_DT1_P, HDMIA8.TCM_DA0_N, HDMIA8.TCM_DA0_P, HDMIA8.TCM_DA1_N, HDMIA8.TCM_DA1_P, HDMIA8.TCM_DT0_N, HDMIA8.TCM_DT0_P, HDMIA8.TCM_DT1_N, HDMIA8.TCM_DT1_P, HDMIA9.TCM_DA0_N, HDMIA9.TCM_DA0_P, HDMIA9.TCM_DA1_N, HDMIA9.TCM_DA1_P, HDMIA9.TCM_DT0_N, HDMIA9.TCM_DT0_P, HDMIA9.TCM_DT1_N, HDMIA9.TCM_DT1_P

### Notes on the sheet
- Project/Equipment
- Document
- Designer
- Drawn by
- Check.by
- Copyright WUT ISE 2024.
  This documentation describes Open Hardware and is licensed under the CERN OHL v.2. You may redistribute and modify this documentation under the terms of the CERN OHL v.2. (http://ohwr.org/CERNOHL). This documentation is distributed WITHOUT ANY EXPRESS OR IMPLIED WARRANTY, INCLUDING OF MERCHANTABILITY, SATISFACTORY QUALITY AND FITNESS FOR A PARTICULAR PURPOSE. Please see the CERN OHL v.2 for applicable conditions.
- Contact
- File
- Last Mod.
- Print Date
- Sheet
- Size
- A3
- of
- Rev

### Library data of the parts
DD6 = XC7K160T-2FBG676C: KINTEX-7, FPGA, 676-Ball BGA, Pb-Free; Part Description: KINTEX-7 FPGA, 162240 Logic Cells, 400 User I/O, 8 GTXs, 676-Ball BGA, Speed Grade 2, Commercial Grade, Pb-Free; Manufacturer: XILINX; PressFit: No; Bonding: No; Part Number: XC7K160T-2FBG676C; Component Kind: Standard; Component Type: Standard; Device: XC7K160T-2FBG676C; PackageDescription: BGA, 1.00mm Pitch, Square; 676 Pin, 26 Columns X 26 Rows, Body 27.0mm X 27.0mm X 2.54mm H, IPC Medium Density; Manufacturer Part Number: XC7K160T-2FBG676C; Pin Count: 676; Case: BGA676; Mounted: Yes; Socket: No; SMD: Yes; Sense: No; ComponentHeight: 2.54mm; HelpURL: \\cern.ch\dfs\Applications\Altium\Datasheets\XC7K160T-xFBG676C.pdf; ComponentLink1URL: \\cern.ch\dfs\Applications\Altium\Datasheets\XC7K160T-xFBG676C_Package-Pinout.pdf; ComponentLink1Description: Package/Pinout; Author: CERN DEM BC; CreateDate: 06.02.2020; LatestRevisionDate: 06.02.2020

## Sheet FPGA_SPI.SchDoc: FIT_PM12 board
size 420 x 297 mm; CheckedBy: G.Kasprowicz; Author: INR Moscow; CompanyName: WUT ISE; DrawnBy: M.Podgórski; Organization: WUT ISE; Address1: PW ISE; Address2: Nowowiejska 15/19 00-665 Warsaw; Address3: gkasprow@gmail.com; Revision: 2; SheetNumber: -; SheetTotal: -; ModifiedBy: -; CheckedDate: -; Title2: Title 2; DivGrp: WUT ISE; Designer: INR RAS; ModifiedDate: -; ProjectName: Sensor Box
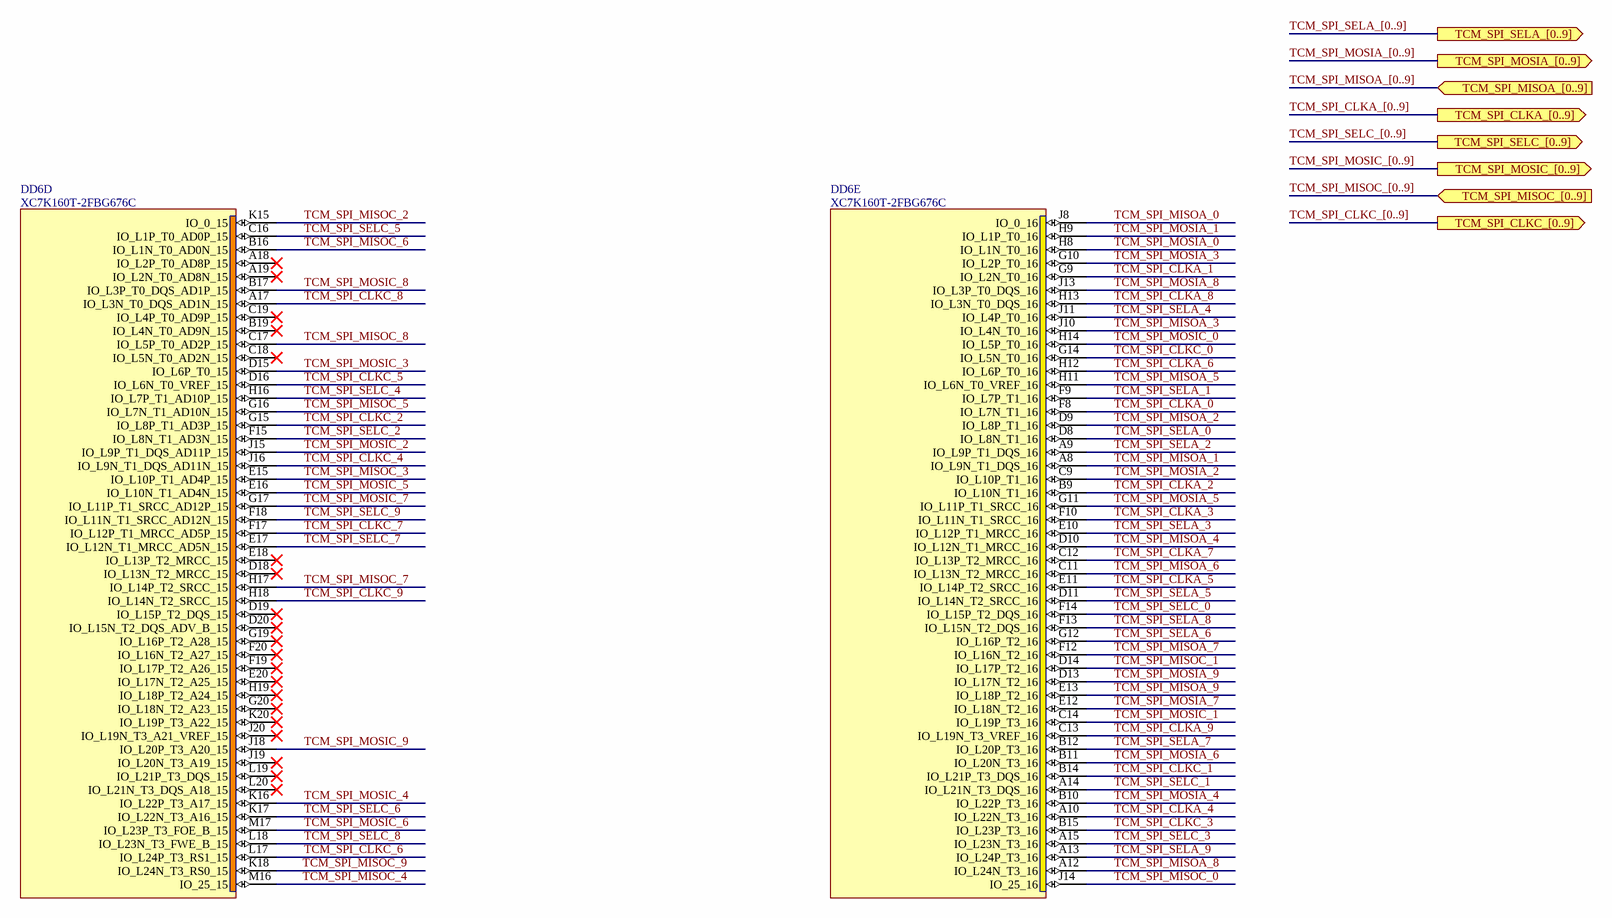
[diagram p16: FPGA_SPI.SchDoc]

### Parts
DD6  XC7K160T-2FBG676C  [BGA676C100P26X26_2700X2700X254]  (parts D,E of 15)

### Ports
TCM_SPI_CLKA_[0..9] (out), TCM_SPI_CLKC_[0..9] (out), TCM_SPI_MISOA_[0..9] (in), TCM_SPI_MISOC_[0..9] (in), TCM_SPI_MOSIA_[0..9] (out), TCM_SPI_MOSIC_[0..9] (out), TCM_SPI_SELA_[0..9] (out), TCM_SPI_SELC_[0..9] (out)

### Nets
TCM_SPI_CLKA_0: DD6.F8(IO_L7N_T1_16)
TCM_SPI_CLKA_1: DD6.G9(IO_L2N_T0_16)
TCM_SPI_CLKA_2: DD6.B9(IO_L10N_T1_16)
TCM_SPI_CLKA_3: DD6.F10(IO_L11N_T1_SRCC_16)
TCM_SPI_CLKA_4: DD6.A10(IO_L22N_T3_16)
TCM_SPI_CLKA_5: DD6.E11(IO_L14P_T2_SRCC_16)
TCM_SPI_CLKA_6: DD6.H12(IO_L6P_T0_16)
TCM_SPI_CLKA_7: DD6.C12(IO_L13P_T2_MRCC_16)
TCM_SPI_CLKA_8: DD6.H13(IO_L3N_T0_DQS_16)
TCM_SPI_CLKA_9: DD6.C13(IO_L19N_T3_VREF_16)
TCM_SPI_CLKC_0: DD6.G14(IO_L5N_T0_16)
TCM_SPI_CLKC_1: DD6.B14(IO_L21P_T3_DQS_16)
TCM_SPI_CLKC_2: DD6.G15(IO_L8P_T1_AD3P_15)
TCM_SPI_CLKC_3: DD6.B15(IO_L23P_T3_16)
TCM_SPI_CLKC_4: DD6.J16(IO_L9N_T1_DQS_AD11N_15)
TCM_SPI_CLKC_5: DD6.D16(IO_L6N_T0_VREF_15)
TCM_SPI_CLKC_6: DD6.L17(IO_L24P_T3_RS1_15)
TCM_SPI_CLKC_7: DD6.F17(IO_L12P_T1_MRCC_AD5P_15)
TCM_SPI_CLKC_8: DD6.A17(IO_L3N_T0_DQS_AD1N_15)
TCM_SPI_CLKC_9: DD6.H18(IO_L14N_T2_SRCC_15)
TCM_SPI_MISOA_0: DD6.J8(IO_0_16)
TCM_SPI_MISOA_1: DD6.A8(IO_L9N_T1_DQS_16)
TCM_SPI_MISOA_2: DD6.D9(IO_L8P_T1_16)
TCM_SPI_MISOA_3: DD6.J10(IO_L4N_T0_16)
TCM_SPI_MISOA_4: DD6.D10(IO_L12N_T1_MRCC_16)
TCM_SPI_MISOA_5: DD6.H11(IO_L6N_T0_VREF_16)
TCM_SPI_MISOA_6: DD6.C11(IO_L13N_T2_MRCC_16)
TCM_SPI_MISOA_7: DD6.F12(IO_L16N_T2_16)
TCM_SPI_MISOA_8: DD6.A12(IO_L24N_T3_16)
TCM_SPI_MISOA_9: DD6.E13(IO_L18P_T2_16)
TCM_SPI_MISOC_0: DD6.J14(IO_25_16)
TCM_SPI_MISOC_1: DD6.D14(IO_L17P_T2_16)
TCM_SPI_MISOC_2: DD6.K15(IO_0_15)
TCM_SPI_MISOC_3: DD6.E15(IO_L10P_T1_AD4P_15)
TCM_SPI_MISOC_4: DD6.M16(IO_25_15)
TCM_SPI_MISOC_5: DD6.G16(IO_L7N_T1_AD10N_15)
TCM_SPI_MISOC_6: DD6.B16(IO_L1N_T0_AD0N_15)
TCM_SPI_MISOC_7: DD6.H17(IO_L14P_T2_SRCC_15)
TCM_SPI_MISOC_8: DD6.C17(IO_L5P_T0_AD2P_15)
TCM_SPI_MISOC_9: DD6.K18(IO_L24N_T3_RS0_15)
TCM_SPI_MOSIA_0: DD6.H8(IO_L1N_T0_16)
TCM_SPI_MOSIA_1: DD6.H9(IO_L1P_T0_16)
TCM_SPI_MOSIA_2: DD6.C9(IO_L10P_T1_16)
TCM_SPI_MOSIA_3: DD6.G10(IO_L2P_T0_16)
TCM_SPI_MOSIA_4: DD6.B10(IO_L22P_T3_16)
TCM_SPI_MOSIA_5: DD6.G11(IO_L11P_T1_SRCC_16)
TCM_SPI_MOSIA_6: DD6.B11(IO_L20N_T3_16)
TCM_SPI_MOSIA_7: DD6.E12(IO_L18N_T2_16)
TCM_SPI_MOSIA_8: DD6.J13(IO_L3P_T0_DQS_16)
TCM_SPI_MOSIA_9: DD6.D13(IO_L17N_T2_16)
TCM_SPI_MOSIC_0: DD6.H14(IO_L5P_T0_16)
TCM_SPI_MOSIC_1: DD6.C14(IO_L19P_T3_16)
TCM_SPI_MOSIC_2: DD6.J15(IO_L9P_T1_DQS_AD11P_15)
TCM_SPI_MOSIC_3: DD6.D15(IO_L6P_T0_15)
TCM_SPI_MOSIC_4: DD6.K16(IO_L22P_T3_A17_15)
TCM_SPI_MOSIC_5: DD6.E16(IO_L10N_T1_AD4N_15)
TCM_SPI_MOSIC_6: DD6.M17(IO_L23P_T3_FOE_B_15)
TCM_SPI_MOSIC_7: DD6.G17(IO_L11P_T1_SRCC_AD12P_15)
TCM_SPI_MOSIC_8: DD6.B17(IO_L3P_T0_DQS_AD1P_15)
TCM_SPI_MOSIC_9: DD6.J18(IO_L20P_T3_A20_15)
TCM_SPI_SELA_0: DD6.D8(IO_L8N_T1_16)
TCM_SPI_SELA_1: DD6.F9(IO_L7P_T1_16)
TCM_SPI_SELA_2: DD6.A9(IO_L9P_T1_DQS_16)
TCM_SPI_SELA_3: DD6.E10(IO_L12P_T1_MRCC_16)
TCM_SPI_SELA_4: DD6.J11(IO_L4P_T0_16)
TCM_SPI_SELA_5: DD6.D11(IO_L14N_T2_SRCC_16)
TCM_SPI_SELA_6: DD6.G12(IO_L16P_T2_16)
TCM_SPI_SELA_7: DD6.B12(IO_L20P_T3_16)
TCM_SPI_SELA_8: DD6.F13(IO_L15N_T2_DQS_16)
TCM_SPI_SELA_9: DD6.A13(IO_L24P_T3_16)
TCM_SPI_SELC_0: DD6.F14(IO_L15P_T2_DQS_16)
TCM_SPI_SELC_1: DD6.A14(IO_L21N_T3_DQS_16)
TCM_SPI_SELC_2: DD6.F15(IO_L8N_T1_AD3N_15)
TCM_SPI_SELC_3: DD6.A15(IO_L23N_T3_16)
TCM_SPI_SELC_4: DD6.H16(IO_L7P_T1_AD10P_15)
TCM_SPI_SELC_5: DD6.C16(IO_L1P_T0_AD0P_15)
TCM_SPI_SELC_6: DD6.K17(IO_L22N_T3_A16_15)
TCM_SPI_SELC_7: DD6.E17(IO_L12N_T1_MRCC_AD5N_15)
TCM_SPI_SELC_8: DD6.L18(IO_L23N_T3_FWE_B_15)
TCM_SPI_SELC_9: DD6.F18(IO_L11N_T1_SRCC_AD12N_15)

Not connected (* = marked no-connect by the designer): DD6 A18(IO_L2P_T0_AD8P_15)* A19(IO_L2N_T0_AD8N_15)* B19(IO_L4N_T0_AD9N_15)* C18(IO_L5N_T0_AD2N_15)* C19(IO_L4P_T0_AD9P_15)* D18(IO_L13N_T2_MRCC_15)* D19(IO_L15P_T2_DQS_15)* D20(IO_L15N_T2_DQS_ADV_B_15)* E18(IO_L13P_T2_MRCC_15)* E20(IO_L17N_T2_A25_15)* F19(IO_L17P_T2_A26_15)* F20(IO_L16N_T2_A27_15)* G19(IO_L16P_T2_A28_15)* G20(IO_L18N_T2_A23_15)* H19(IO_L18P_T2_A24_15)* J19(IO_L20N_T3_A19_15)* J20(IO_L19N_T3_A21_VREF_15)* K20(IO_L19P_T3_A22_15)* L19(IO_L21P_T3_DQS_15)* L20(IO_L21N_T3_DQS_A18_15)*

### Buses and harness runs
bus TCM_SPI_CLKA_[0..9] = port TCM_SPI_CLKA_[0..9]
bus TCM_SPI_CLKC_[0..9] = port TCM_SPI_CLKC_[0..9]
bus TCM_SPI_MISOA_[0..9] = port TCM_SPI_MISOA_[0..9]
bus TCM_SPI_MISOC_[0..9] = port TCM_SPI_MISOC_[0..9]
bus TCM_SPI_MOSIA_[0..9] = port TCM_SPI_MOSIA_[0..9]
bus TCM_SPI_MOSIC_[0..9] = port TCM_SPI_MOSIC_[0..9]
bus TCM_SPI_SELA_[0..9] = port TCM_SPI_SELA_[0..9]
bus TCM_SPI_SELC_[0..9] = port TCM_SPI_SELC_[0..9]

### Notes on the sheet
- Project/Equipment
- Document
- Designer
- Drawn by
- Check.by
- Copyright WUT ISE 2024.
  This documentation describes Open Hardware and is licensed under the CERN OHL v.2. You may redistribute and modify this documentation under the terms of the CERN OHL v.2. (http://ohwr.org/CERNOHL). This documentation is distributed WITHOUT ANY EXPRESS OR IMPLIED WARRANTY, INCLUDING OF MERCHANTABILITY, SATISFACTORY QUALITY AND FITNESS FOR A PARTICULAR PURPOSE. Please see the CERN OHL v.2 for applicable conditions.
- Contact
- File
- Last Mod.
- Print Date
- Sheet
- Size
- A3
- of
- Rev

### Library data of the parts
DD6 = XC7K160T-2FBG676C: as DD6 on sheet FIT_FPGA_E_G-H; Part Number: XC7K160T-2FBG676C; Component Kind: Standard; Component Type: Standard; Device: XC7K160T-2FBG676C; PackageDescription: BGA, 1.00mm Pitch, Square; 676 Pin, 26 Columns X 26 Rows, Body 27.0mm X 27.0mm X 2.54mm H, IPC Medium Density; Manufacturer Part Number: XC7K160T-2FBG676C; Pin Count: 676; Case: BGA676; Mounted: Yes; Socket: No; SMD: Yes; Sense: No; ComponentHeight: 2.54mm; HelpURL: \\cern.ch\dfs\Applications\Altium\Datasheets\XC7K160T-xFBG676C.pdf; ComponentLink1URL: \\cern.ch\dfs\Applications\Altium\Datasheets\XC7K160T-xFBG676C_Package-Pinout.pdf; ComponentLink1Description: Package/Pinout; Author: CERN DEM BC; CreateDate: 06.02.2020; LatestRevisionDate: 06.02.2020

## Sheet FIT_FPGA_A-C.SchDoc: FIT_PM12 board
size 420 x 297 mm; CheckedBy: G.Kasprowicz; Author: INR Moscow; CompanyName: WUT ISE; DrawnBy: M.Podgórski; Organization: WUT ISE; Address1: PW ISE; Address2: Nowowiejska 15/19 00-665 Warsaw; Address3: gkasprow@gmail.com; Revision: 2; SheetNumber: -; SheetTotal: -; ModifiedBy: -; CheckedDate: -; Title2: Title 2; DivGrp: WUT ISE; Designer: INR RAS; ModifiedDate: -; ProjectName: Sensor Box
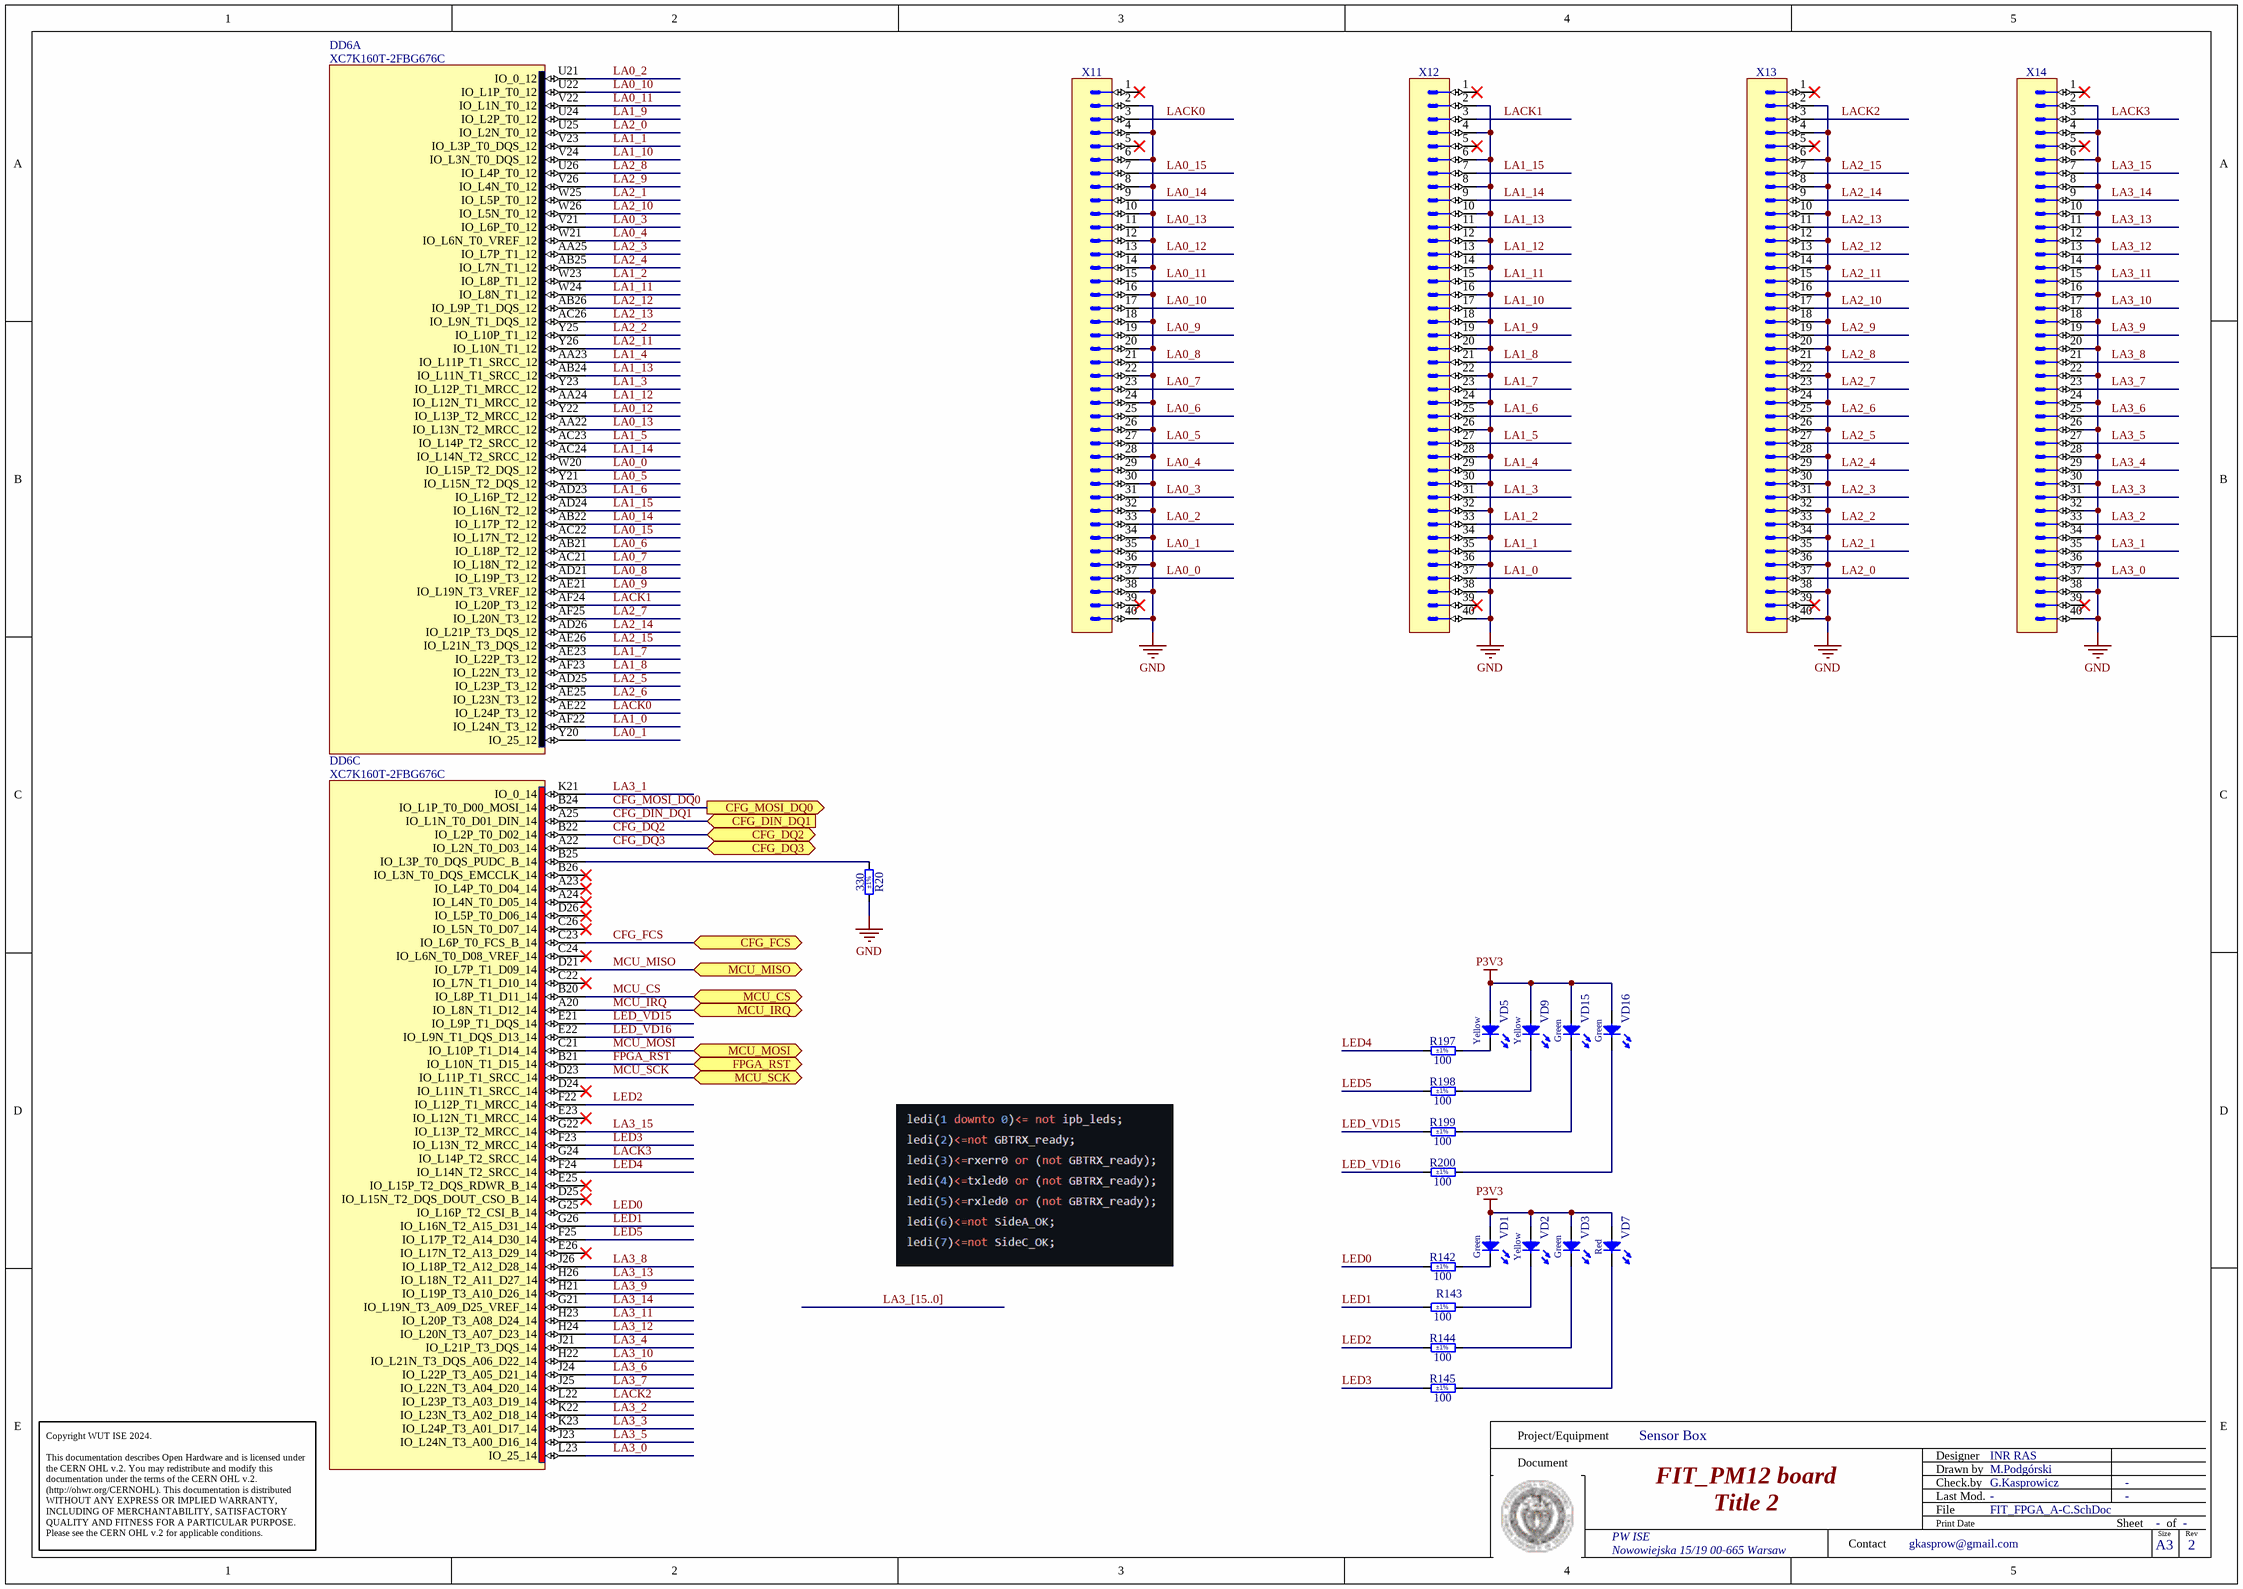
[diagram p17: FIT_FPGA_A-C.SchDoc]

### Parts
DD6  XC7K160T-2FBG676C  [BGA676C100P26X26_2700X2700X254]  (parts A,C of 15)
R20  330  Tolerance: ±1%  [RESC2012X60N]
R142  100  Tolerance: ±1%  [RESC2012X60N]
R143  100  Tolerance: ±1%  [RESC2012X60N]
R144  100  Tolerance: ±1%  [RESC2012X60N]
R145  100  Tolerance: ±1%  [RESC2012X60N]
R197  100  Tolerance: ±1%  [RESC2012X60N]
R198  100  Tolerance: ±1%  [RESC2012X60N]
R199  100  Tolerance: ±1%  [RESC2012X60N]
R200  100  Tolerance: ±1%  [RESC2012X60N]
VD1  Green  [LED_KINGBRIGHT_KP-2012LSGC]
VD2  Yellow  [LED_KINGBRIGHT_KPT-2012YC]
VD3  Green  [LED_KINGBRIGHT_KP-2012LSGC]
VD5  Yellow  [LED_KINGBRIGHT_KPT-2012YC]
VD7  Red  [LED_KINGBRIGHT_KPT-2012SURCK]
VD9  Yellow  [LED_KINGBRIGHT_KPT-2012YC]
VD15  Green  [LED_KINGBRIGHT_KP-2012LSGC]
VD16  Green  [LED_KINGBRIGHT_KP-2012LSGC]
X11  (no value)  [CONNFLY_DS1013-40SSIB1-B-0]
X12  (no value)  [CONNFLY_DS1013-40SSIB1-B-0]
X13  (no value)  [CONNFLY_DS1013-40SSIB1-B-0]
X14  (no value)  [CONNFLY_DS1013-40SSIB1-B-0]

### Ports
CFG_DIN_DQ1 (in), CFG_DQ2 (bidir), CFG_DQ3 (bidir), CFG_FCS (bidir), CFG_MOSI_DQ0 (out), FPGA_RST (bidir), MCU_CS (bidir), MCU_IRQ (bidir), MCU_MISO (bidir), MCU_MOSI (bidir), MCU_SCK (bidir)

### Nets
GND: R20.2 X11.2 X11.4 X11.6 X11.8 X11.10 X11.12 X11.14 X11.16 X11.18 X11.20 X11.22 X11.24 X11.26 X11.28 X11.30 X11.32 X11.34 X11.36 X11.38 X11.40 X12.2 X12.4 X12.6 X12.8 X12.10 X12.12 X12.14 X12.16 X12.18 X12.20 X12.22 X12.24 X12.26 X12.28 X12.30 X12.32 X12.34 X12.36 X12.38 X12.40 X13.2 X13.4 X13.6 X13.8 X13.10 X13.12 X13.14 X13.16 X13.18 X13.20 X13.22 X13.24 X13.26 X13.28 X13.30 X13.32 X13.34 X13.36 X13.38 X13.40 X14.2 X14.4 X14.6 X14.8 X14.10 X14.12 X14.14 X14.16 X14.18 X14.20 X14.22 X14.24 X14.26 X14.28 X14.30 X14.32 X14.34 X14.36 X14.38 X14.40
P3V3: VD1.2(A) VD2.2(A) VD3.2(A) VD5.2(A) VD7.2(A) VD9.2(A) VD15.2(A) VD16.2(A)
CFG_DIN_DQ1: DD6.A25(IO_L1N_T0_D01_DIN_14) ; port CFG_DIN_DQ1
CFG_DQ2: DD6.B22(IO_L2P_T0_D02_14) ; port CFG_DQ2
CFG_DQ3: DD6.A22(IO_L2N_T0_D03_14) ; port CFG_DQ3
CFG_FCS: DD6.C23(IO_L6P_T0_FCS_B_14) ; port CFG_FCS
CFG_MOSI_DQ0: DD6.B24(IO_L1P_T0_D00_MOSI_14) ; port CFG_MOSI_DQ0
FPGA_RST: DD6.B21(IO_L10N_T1_D15_14) ; port FPGA_RST
LA0_0: DD6.W20(IO_L15P_T2_DQS_12) X11.37
LA0_1: DD6.Y20(IO_25_12) X11.35
LA0_2: DD6.U21(IO_0_12) X11.33
LA0_3: DD6.V21(IO_L6P_T0_12) X11.31
LA0_4: DD6.W21(IO_L6N_T0_VREF_12) X11.29
LA0_5: DD6.Y21(IO_L15N_T2_DQS_12) X11.27
LA0_6: DD6.AB21(IO_L18P_T2_12) X11.25
LA0_7: DD6.AC21(IO_L18N_T2_12) X11.23
LA0_8: DD6.AD21(IO_L19P_T3_12) X11.21
LA0_9: DD6.AE21(IO_L19N_T3_VREF_12) X11.19
LA0_10: DD6.U22(IO_L1P_T0_12) X11.17
LA0_11: DD6.V22(IO_L1N_T0_12) X11.15
LA0_12: DD6.Y22(IO_L13P_T2_MRCC_12) X11.13
LA0_13: DD6.AA22(IO_L13N_T2_MRCC_12) X11.11
LA0_14: DD6.AB22(IO_L17P_T2_12) X11.9
LA0_15: DD6.AC22(IO_L17N_T2_12) X11.7
LA1_0: DD6.AF22(IO_L24N_T3_12) X12.37
LA1_1: DD6.V23(IO_L3P_T0_DQS_12) X12.35
LA1_2: DD6.W23(IO_L8P_T1_12) X12.33
LA1_3: DD6.Y23(IO_L12P_T1_MRCC_12) X12.31
LA1_4: DD6.AA23(IO_L11P_T1_SRCC_12) X12.29
LA1_5: DD6.AC23(IO_L14P_T2_SRCC_12) X12.27
LA1_6: DD6.AD23(IO_L16P_T2_12) X12.25
LA1_7: DD6.AE23(IO_L22P_T3_12) X12.23
LA1_8: DD6.AF23(IO_L22N_T3_12) X12.21
LA1_9: DD6.U24(IO_L2P_T0_12) X12.19
LA1_10: DD6.V24(IO_L3N_T0_DQS_12) X12.17
LA1_11: DD6.W24(IO_L8N_T1_12) X12.15
LA1_12: DD6.AA24(IO_L12N_T1_MRCC_12) X12.13
LA1_13: DD6.AB24(IO_L11N_T1_SRCC_12) X12.11
LA1_14: DD6.AC24(IO_L14N_T2_SRCC_12) X12.9
LA1_15: DD6.AD24(IO_L16N_T2_12) X12.7
LA2_0: DD6.U25(IO_L2N_T0_12) X13.37
LA2_1: DD6.W25(IO_L5P_T0_12) X13.35
LA2_2: DD6.Y25(IO_L10P_T1_12) X13.33
LA2_3: DD6.AA25(IO_L7P_T1_12) X13.31
LA2_4: DD6.AB25(IO_L7N_T1_12) X13.29
LA2_5: DD6.AD25(IO_L23P_T3_12) X13.27
LA2_6: DD6.AE25(IO_L23N_T3_12) X13.25
LA2_7: DD6.AF25(IO_L20N_T3_12) X13.23
LA2_8: DD6.U26(IO_L4P_T0_12) X13.21
LA2_9: DD6.V26(IO_L4N_T0_12) X13.19
LA2_10: DD6.W26(IO_L5N_T0_12) X13.17
LA2_11: DD6.Y26(IO_L10N_T1_12) X13.15
LA2_12: DD6.AB26(IO_L9P_T1_DQS_12) X13.13
LA2_13: DD6.AC26(IO_L9N_T1_DQS_12) X13.11
LA2_14: DD6.AD26(IO_L21P_T3_DQS_12) X13.9
LA2_15: DD6.AE26(IO_L21N_T3_DQS_12) X13.7
LA3_0: DD6.L23(IO_25_14) X14.37
LA3_1: DD6.K21(IO_0_14) X14.35
LA3_2: DD6.K22(IO_L23N_T3_A02_D18_14) X14.33
LA3_3: DD6.K23(IO_L24P_T3_A01_D17_14) X14.31
LA3_4: DD6.J21(IO_L21P_T3_DQS_14) X14.29
LA3_5: DD6.J23(IO_L24N_T3_A00_D16_14) X14.27
LA3_6: DD6.J24(IO_L22P_T3_A05_D21_14) X14.25
LA3_7: DD6.J25(IO_L22N_T3_A04_D20_14) X14.23
LA3_8: DD6.J26(IO_L18P_T2_A12_D28_14) X14.21
LA3_9: DD6.H21(IO_L19P_T3_A10_D26_14) X14.19
LA3_10: DD6.H22(IO_L21N_T3_DQS_A06_D22_14) X14.17
LA3_11: DD6.H23(IO_L20P_T3_A08_D24_14) X14.15
LA3_12: DD6.H24(IO_L20N_T3_A07_D23_14) X14.13
LA3_13: DD6.H26(IO_L18N_T2_A11_D27_14) X14.11
LA3_14: DD6.G21(IO_L19N_T3_A09_D25_VREF_14) X14.9
LA3_15: DD6.G22(IO_L13P_T2_MRCC_14) X14.7
LACK0: DD6.AE22(IO_L24P_T3_12) X11.3
LACK1: DD6.AF24(IO_L20P_T3_12) X12.3
LACK2: DD6.L22(IO_L23P_T3_A03_D19_14) X13.3
LACK3: DD6.G24(IO_L14P_T2_SRCC_14) X14.3
LED0: DD6.G25(IO_L16P_T2_CSI_B_14) R142.1
LED1: DD6.G26(IO_L16N_T2_A15_D31_14) R143.1
LED2: DD6.F22(IO_L12P_T1_MRCC_14) R144.1
LED3: DD6.F23(IO_L13N_T2_MRCC_14) R145.1
LED4: DD6.F24(IO_L14N_T2_SRCC_14) R197.1
LED5: DD6.F25(IO_L17P_T2_A14_D30_14) R198.1
LED_VD15: DD6.E21(IO_L9P_T1_DQS_14) R199.1
LED_VD16: DD6.E22(IO_L9N_T1_DQS_D13_14) R200.1
MCU_CS: DD6.B20(IO_L8P_T1_D11_14) ; port MCU_CS
MCU_IRQ: DD6.A20(IO_L8N_T1_D12_14) ; port MCU_IRQ
MCU_MISO: DD6.D21(IO_L7P_T1_D09_14) ; port MCU_MISO
MCU_MOSI: DD6.C21(IO_L10P_T1_D14_14) ; port MCU_MOSI
MCU_SCK: DD6.D23(IO_L11P_T1_SRCC_14) ; port MCU_SCK
NetDD6_B25: DD6.B25(IO_L3P_T0_DQS_PUDC_B_14) R20.1
NetR142_2: R142.2 VD1.1(C)
NetR143_2: R143.2 VD2.1(C)
NetR144_2: R144.2 VD3.1(C)
NetR145_2: R145.2 VD7.1(C)
NetR197_2: R197.2 VD5.1(C)
NetR198_2: R198.2 VD9.1(C)
NetR199_2: R199.2 VD15.1(C)
NetR200_2: R200.2 VD16.1(C)

Not connected (* = marked no-connect by the designer): DD6 A23(IO_L4P_T0_D04_14)* A24(IO_L4N_T0_D05_14)* B26(IO_L3N_T0_DQS_EMCCLK_14)* C22(IO_L7N_T1_D10_14)* C24(IO_L6N_T0_D08_VREF_14)* C26(IO_L5N_T0_D07_14)* D24(IO_L11N_T1_SRCC_14)* D25(IO_L15N_T2_DQS_DOUT_CSO_B_14)* D26(IO_L5P_T0_D06_14)* E23(IO_L12N_T1_MRCC_14)* E25(IO_L15P_T2_DQS_RDWR_B_14)* E26(IO_L17N_T2_A13_D29_14)*; X11 1* 5* 39*; X12 1* 5* 39*; X13 1* 5* 39*; X14 1* 5* 39*

### Buses and harness runs
bus LA3_[15..0]

### Notes on the sheet
- Project/Equipment
- Document
- Designer
- Drawn by
- Check.by
- Copyright WUT ISE 2024.
  This documentation describes Open Hardware and is licensed under the CERN OHL v.2. You may redistribute and modify this documentation under the terms of the CERN OHL v.2. (http://ohwr.org/CERNOHL). This documentation is distributed WITHOUT ANY EXPRESS OR IMPLIED WARRANTY, INCLUDING OF MERCHANTABILITY, SATISFACTORY QUALITY AND FITNESS FOR A PARTICULAR PURPOSE. Please see the CERN OHL v.2 for applicable conditions.
- Contact
- File
- Last Mod.
- Print Date
- Sheet
- Size
- A3
- of
- Rev

### Library data of the parts
DD6 = XC7K160T-2FBG676C: as DD6 on sheet FIT_FPGA_E_G-H; Part Number: XC7K160T-2FBG676C; Component Kind: Standard; Component Type: Standard; Device: XC7K160T-2FBG676C; PackageDescription: BGA, 1.00mm Pitch, Square; 676 Pin, 26 Columns X 26 Rows, Body 27.0mm X 27.0mm X 2.54mm H, IPC Medium Density; Manufacturer Part Number: XC7K160T-2FBG676C; Pin Count: 676; Case: BGA676; Mounted: Yes; Socket: No; SMD: Yes; Sense: No; ComponentHeight: 2.54mm; HelpURL: \\cern.ch\dfs\Applications\Altium\Datasheets\XC7K160T-xFBG676C.pdf; ComponentLink1URL: \\cern.ch\dfs\Applications\Altium\Datasheets\XC7K160T-xFBG676C_Package-Pinout.pdf; ComponentLink1Description: Package/Pinout; Author: CERN DEM BC; CreateDate: 06.02.2020; LatestRevisionDate: 06.02.2020
R20 = R0805_330R_1%_0.125W_100PPM: Resistor - 1%; Part Description: General Purpose Thick Film Chip Resistor; Manufacturer: GENERIC; Manufacturer1 Part Number: NRC10F3300TRF; Power: 0.125W; TC: ±100ppm/°C; PressFit: No; Part Number: R0805_330R_1%_0.125W_100PPM; Component Kind: Standard; Component Type: Standard; Pin Count: 2; Value: 330; Status: Preferred; Manufacturer Part Number: R0805_330R_1%_0.125W_100PPM; Case: 0805; Mounted: Yes; Sense: No; Socket: No; SMD: Yes; Manufacturer1 Example: NIC COMPONENT; Manufacturer1 ComponentHeight: 0.6mm; HelpURL: \\cern.ch\dfs\Applications\Altium\Datasheets\R0805_NIC_NRC.pdf; Author: CERN DEM JLC; CreateDate: 03.12.2007; LatestRevisionDate: 13.03.2008
R142-R145 R197-R200 = R0805_100R_1%_0.125W_100PPM: Resistor - 1%; Part Description: General Purpose Thick Film Chip Resistor; Manufacturer: GENERIC; Manufacturer1 Part Number: NRC10F4700TRF; Power: 0.125W; TC: ±100ppm/°C; PressFit: No; Part Number: R0805_100R_1%_0.125W_100PPM; Component Kind: Standard; Component Type: Standard; Pin Count: 2; Value: 100; Status: Preferred; Manufacturer Part Number: R0805_100R_1%_0.125W_100PPM; Case: 0805; Mounted: Yes; Sense: No; Socket: No; SMD: Yes; Manufacturer1 Example: NIC COMPONENT; Manufacturer1 ComponentHeight: 0.6mm; HelpURL: \\cern.ch\dfs\Applications\Altium\Datasheets\R0805_NIC_NRC.pdf; Author: CERN DEM JLC; CreateDate: 03.12.2007; LatestRevisionDate: 13.03.2008
VD1 VD3 VD15 VD16 = LED_KINGBRIGHT_KP-2012LSGC: LED Green 1C 2A; Part Description: 2.0x1.2mm Surface Mount Green LED; PressFit: No; Bonding: No; Part Number: LED_KINGBRIGHT_KP-2012LSGC; Component Kind: Standard; Component Type: Standard; Color: Green; PackageDescription: 2.0x1.2mm Surface Mount Green LED; Manufacturer: KINGBRIGHT; Manufacturer Part Number: KP-2012LSGC; Pin Count: 2; Case: 0805; Mounted: Yes; Socket: No; SMD: Yes; Sense: No; ComponentHeight: 1.1mm; HelpURL: \\cern.ch\dfs\Applications\Altium\Datasheets\LED_KINGBRIGHT_KP-2012LSGC.pdf; Author: CERN DEM BC; CreateDate: 09.11.2020; LatestRevisionDate: 09.11.2020
VD2 VD5 VD9 = LED_KINGBRIGHT_KPT-2012YC: LED Yellow 1C 2A; Part Description: 2.0X1.25mm, SMD Yellow Chip LED Lamp, KPT-2012 Series; PressFit: No; Bonding: No; Part Number: LED_KINGBRIGHT_KPT-2012YC; Component Kind: Standard; Component Type: Standard; Color: Yellow; PackageDescription: SMT Yellow LED, Case 2012, Body L 2.00mm X  W 1.25mm X H 0.75mm; Manufacturer: KINGBRIGHT; Manufacturer Part Number: KPT-2012YC; Pin Count: 2; Case: 0805; Mounted: Yes; Socket: No; SMD: Yes; Sense: No; ComponentHeight: 0.75mm; HelpURL: \\cern.ch\dfs\Applications\Altium\Datasheets\LED_KINGBRIGHT_KPT-2012YC.pdf; Author: CERN DEM JMW; CreateDate: 24.08.2021; LatestRevisionDate: 24.08.2021
VD7 = LED_KINGBRIGHT_KPT-2012SURCK: LED Red 1C 2A; Part Description: 2.0X1.25mm, SMD Hyper Red Chip LED Lamp, KPT-2012 Series; PressFit: No; Bonding: No; Part Number: LED_KINGBRIGHT_KPT-2012SURCK; Component Kind: Standard; Component Type: Standard; Color: Red; PackageDescription: SMT Hyper Red LED, Case 2012, Body L 2.00mm X  W 1.25mm X H 0.75mm; Manufacturer: KINGBRIGHT; Manufacturer Part Number: KPT-2012SURCK; Pin Count: 2; Case: 0805; Mounted: Yes; Socket: No; SMD: Yes; Sense: No; ComponentHeight: 0.75mm; HelpURL: \\cern.ch\dfs\Applications\Altium\Datasheets\LED_KINGBRIGHT_KPT-2012SURCK.pdf; Author: CERN DEM BC; CreateDate: 06.11.2020; LatestRevisionDate: 06.11.2020
X11-X14 = CONNFLY_DS1013-40SSIB1-B-0: Connector 40 Male; Part Description: 40 Contacts, 2.54mm Box Header V/T,R/A & SMT Type; PressFit: No; Part Number: CONNFLY_DS1013-40SSIB1-B-0; Component Kind: Standard; Component Type: Standard; Pin Count: 40; Mounted: Yes; Socket: No; SMD: No; Sense: No; Status: None; Manufacturer: CONNFLY; Manufacturer Part Number: DS1013-40SSIB1-B-0; ComponentHeight: 9.1mm; HelpURL: \\cern.ch\dfs\Applications\Altium\Datasheets\CONNFLY_DS1013.pdf; Author: CERN DEM HF; CreateDate: 30.05.2024; LatestRevisionDate: 30.05.2024